# Altium project HYDRA_V4_POWER.PrjPcb (part 1 of 2)
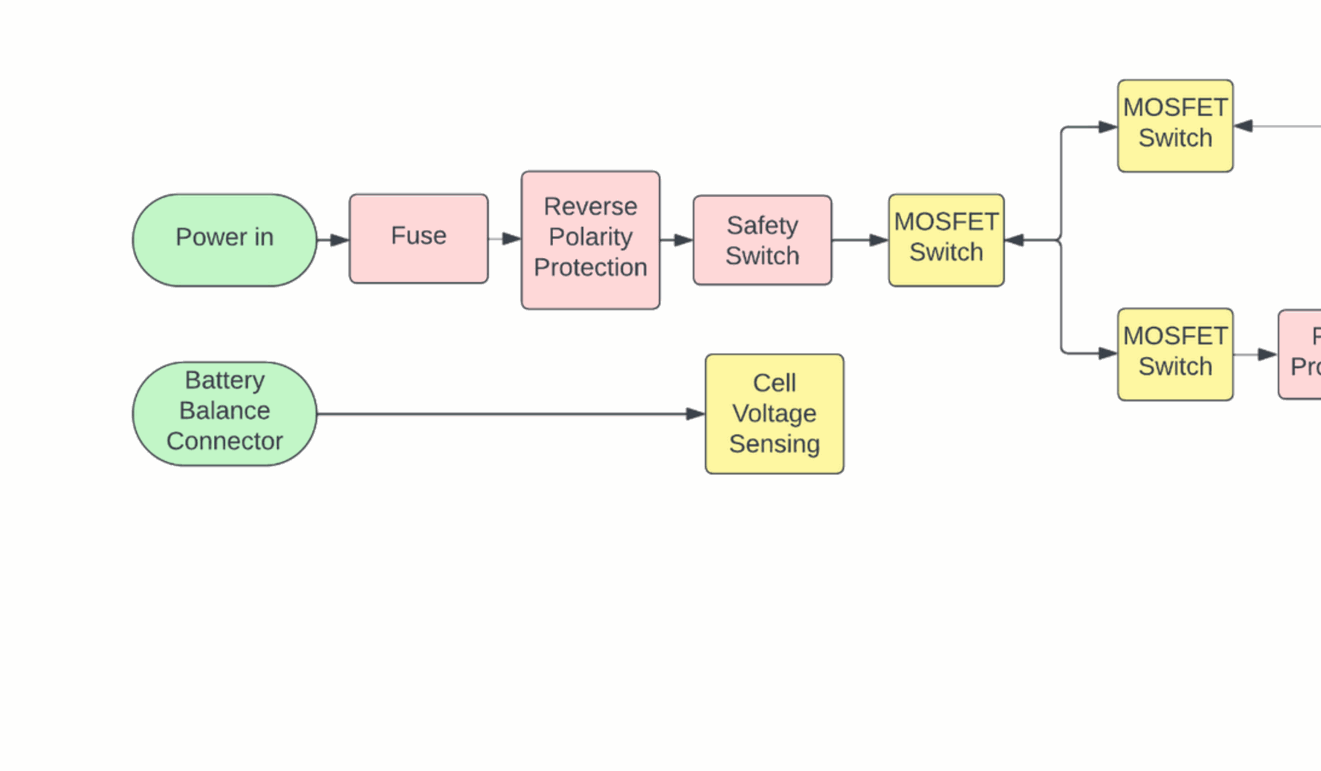
[diagram p0: HYDRA_V4_POWER.SchDoc, top left]
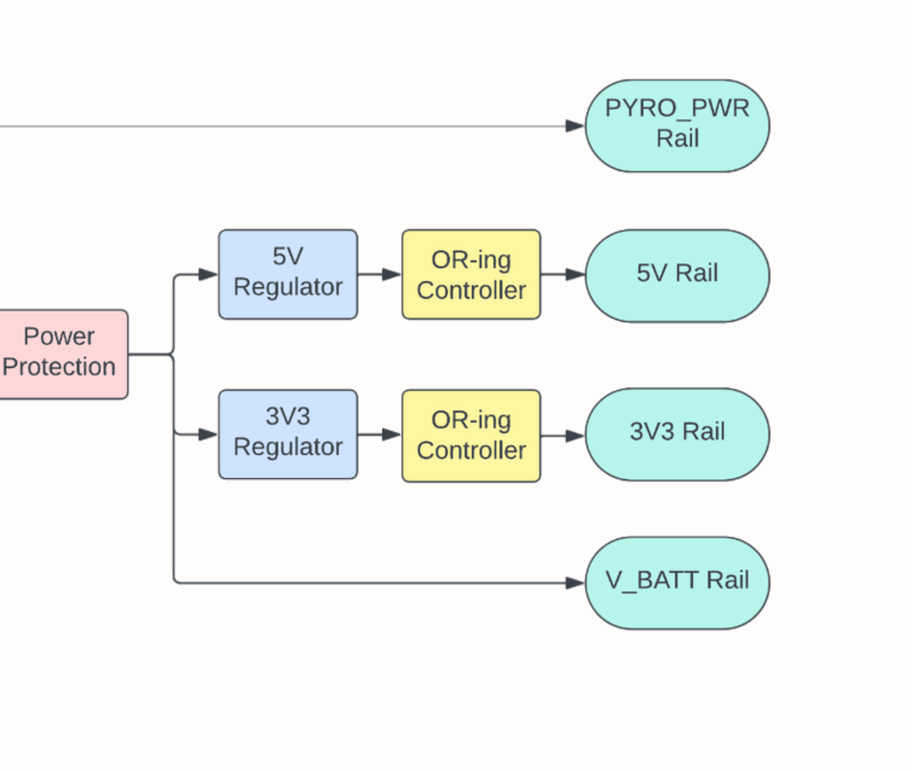
[diagram p1: HYDRA_V4_POWER.SchDoc, top right]
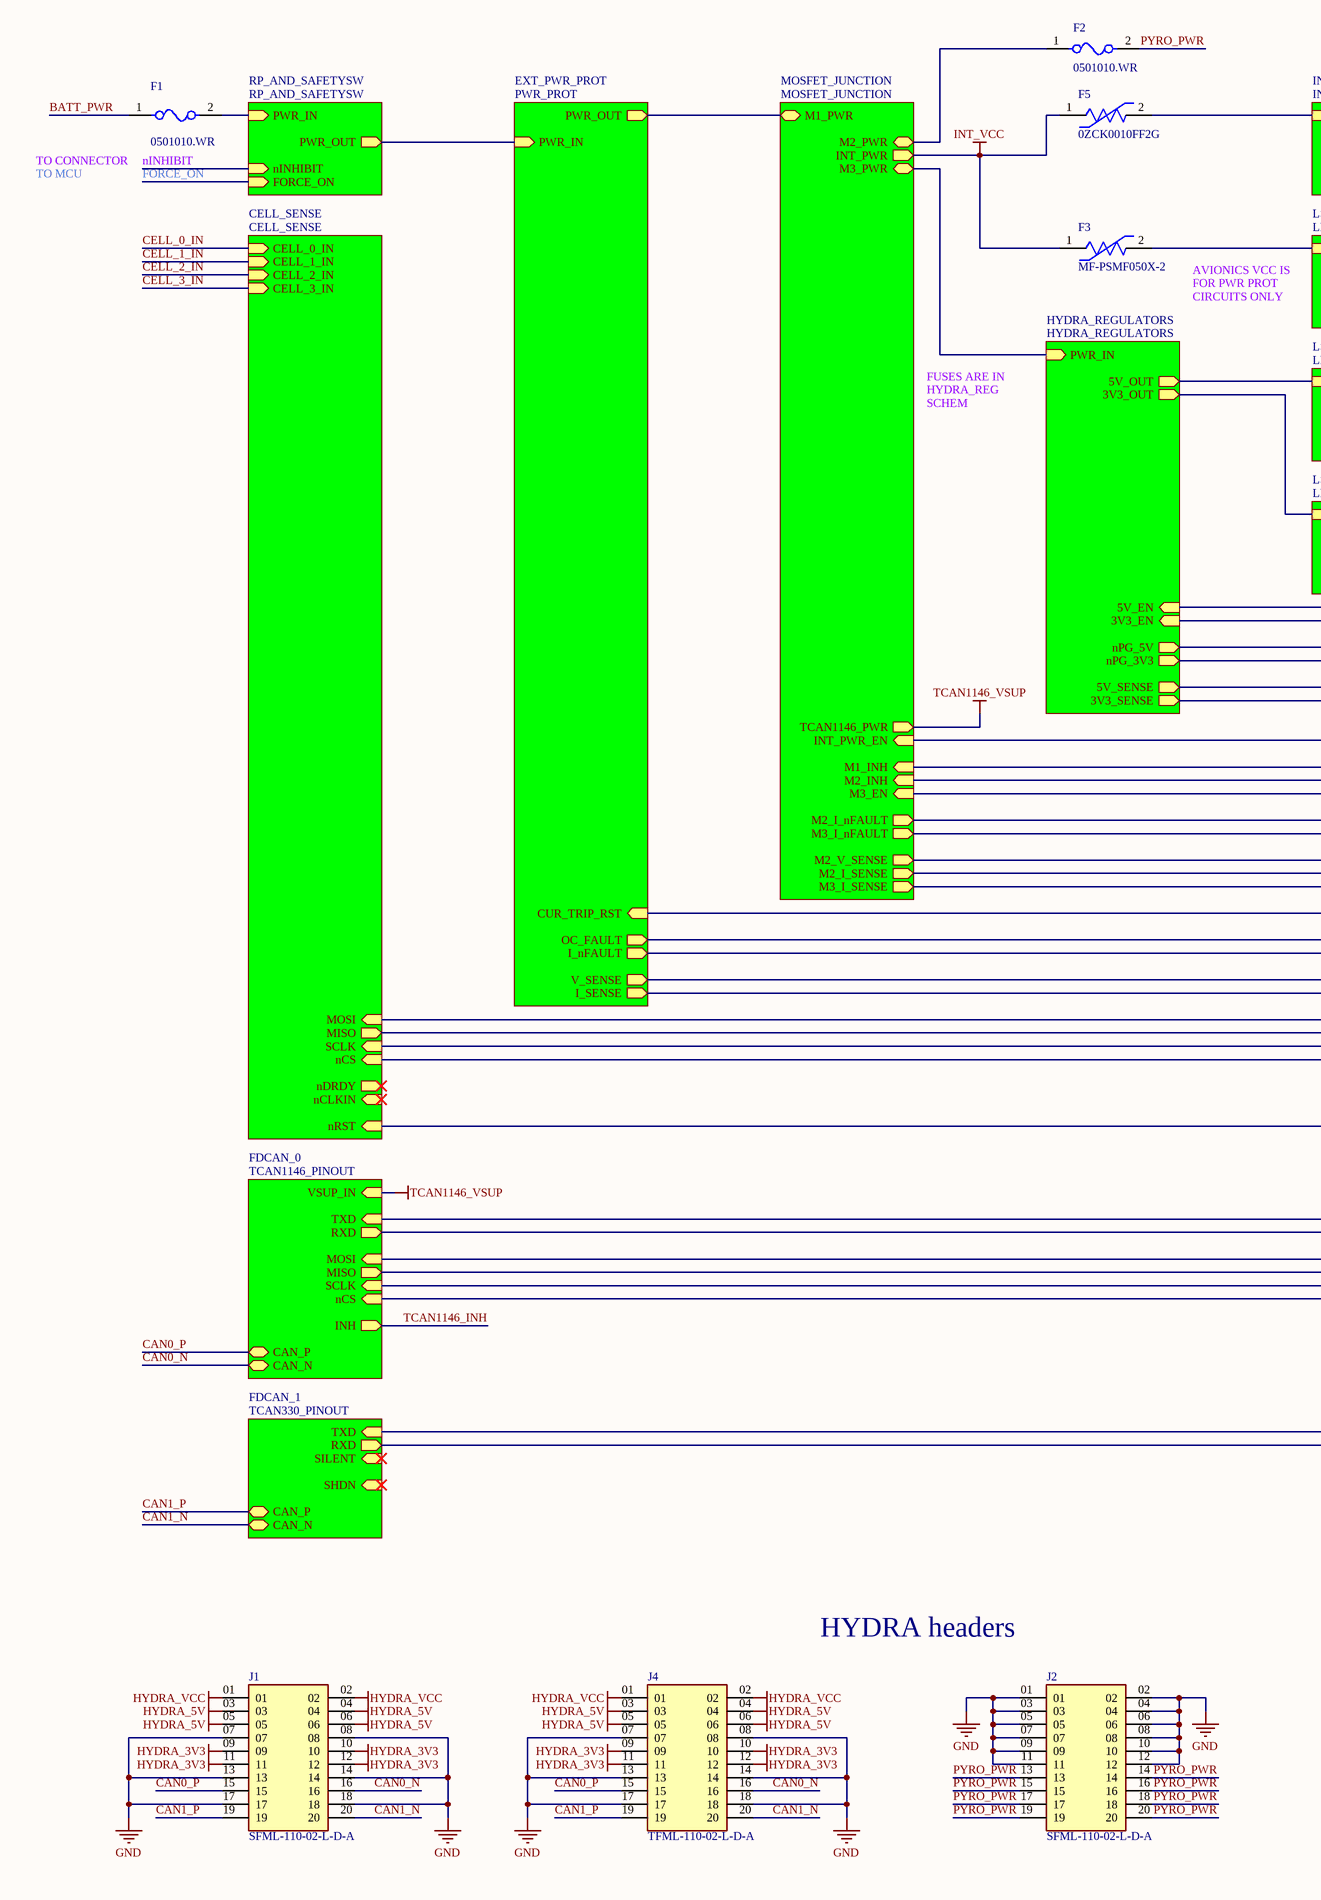
[diagram p2: HYDRA_V4_POWER.SchDoc, bottom left]
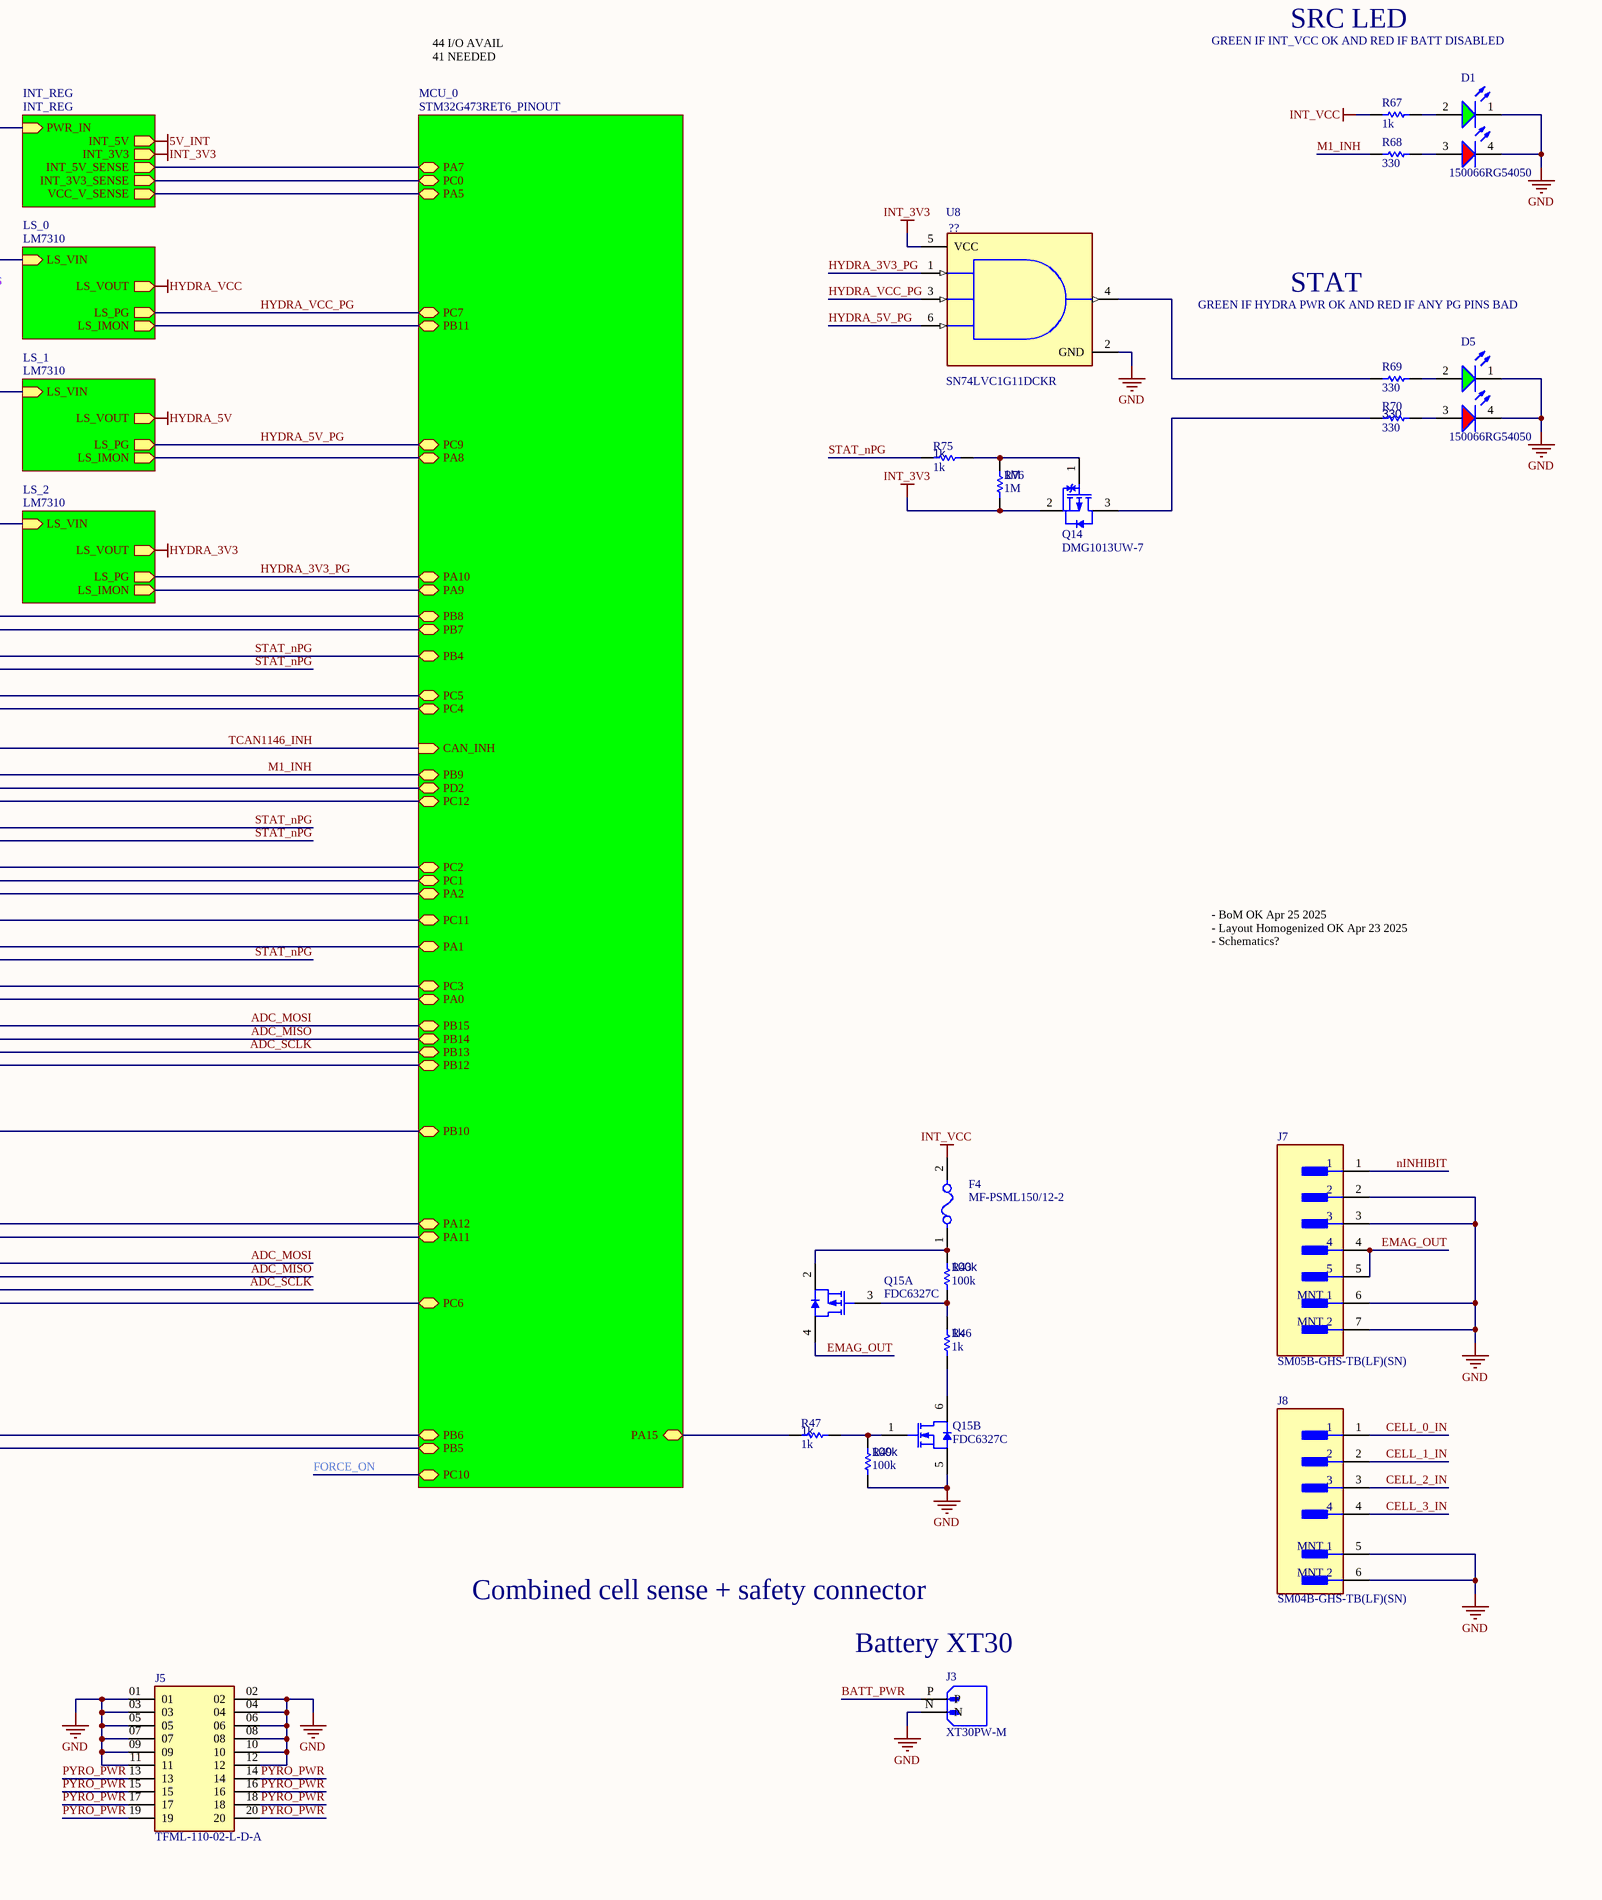
[diagram p3: HYDRA_V4_POWER.SchDoc, bottom right]
11 sheets, 220 parts. Net scope: hierarchical (ports join the sheet entries above them; power ports are global).
Board file: HYDRA_V4_POWER.PcbDoc
Sheets:
  HYDRA_V4_POWER.SchDoc
    MCU_0 = STM32G473RET6_PINOUT.SchDoc
    EXT_PWR_PROT = PWR_PROT.SchDoc
    CELL_SENSE = CELL_SENSE.SchDoc
    MOSFET_JUNCTION = MOSFET_JUNCTION.SchDoc
    INT_REG = INT_REG.SchDoc
    HYDRA_REGULATORS = HYDRA_REGULATORS.SchDoc
    RP_AND_SAFETYSW = RP_AND_SAFETYSW.SchDoc
    LS_0 = LM7310.SchDoc
    LS_1 = LM7310.SchDoc
    LS_2 = LM7310.SchDoc
    FDCAN_1 = TCAN330_PINOUT.SchDoc
    FDCAN_0 = TCAN1146_PINOUT.SchDoc

## Sheet HYDRA_V4_POWER.SchDoc
size A2; SheetNumber: 1; SheetTotal: 11

### Parts
D1  150066RG54050  [WL-SBCD_0606]
D5  150066RG54050  [WL-SBCD_0606]
F1  0501010.WR  [FP-0501-MFG]
F2  0501010.WR  [FP-0501-MFG]
F3  MF-PSMF050X-2  [FP-MF-PSMF-MFG]
F4  MF-PSML150/12-2  [FP-0805L010-MFG]
F5  0ZCK0010FF2G  [FP-0ZCK0010FF2G-MFG]
J1  SFML-110-02-L-D-A  [SFML-110-02-L-D-A-Footprint-1]
J2  SFML-110-02-L-D-A  [SFML-110-02-L-D-A-Footprint-1]
J3  XT30PW-M  [XT30PW-M-Footprint-1]
J4  TFML-110-02-L-D-A  [TFML-110-02-L-D-A-Footprint-1]
J5  TFML-110-02-L-D-A  [TFML-110-02-L-D-A-Footprint-1]
J7  SM05B-GHS-TB(LF)(SN)  [FP-SM05B-GHS-TB_LF_SN-MFG]
J8  SM04B-GHS-TB(LF)(SN)  [FP-SM04B-GHS-TB_LF_SN-MFG]
Q14  DMG1013UW-7  [DIOD-SOT323-3_V]
Q15  FDC6327C  [FAIR-SOT23-6_V]  (parts A,B of 2)
R43  100k  [R0603B]
R46  1k  [R0603B]
R47  1k  [R0603B]
R49  100k  [R0603B]
R67  1k  [R0603B]
R68  330  [R0603B]
R69  330  [R0603B]
R70  330  [R0603B]
R75  1k  [R0603B]
R76  1M  [R0603B]
U8  SN74LVC1G11DCKR  [FP-DCK0006A-MFG]  (value not drawn)

### Sub-sheets
CELL_SENSE = CELL_SENSE: CELL_0_IN (in), CELL_1_IN (in), CELL_2_IN (in), CELL_3_IN (in), MOSI (in), MISO (out), SCLK (in), nCS (in), nRST (in), nDRDY (out), nCLKIN (in)
EXT_PWR_PROT = PWR_PROT: PWR_IN (in), PWR_OUT (out), V_SENSE (out), I_SENSE (out), CUR_TRIP_RST (in), OC_FAULT (out), I_nFAULT (out)
FDCAN_0 = TCAN1146_PINOUT: TXD (in), RXD (out), MOSI (in), MISO (out), SCLK (in), nCS (in), INH (out), CAN_P (bidir), CAN_N (bidir), VSUP_IN (in)
FDCAN_1 = TCAN330_PINOUT: TXD (in), RXD (out), SHDN (in), SILENT (in), CAN_P (bidir), CAN_N (bidir)
HYDRA_REGULATORS = HYDRA_REGULATORS: PWR_IN (in), 5V_OUT (out), 3V3_OUT (out), 5V_SENSE (out), 3V3_SENSE (out), 5V_EN (in), 3V3_EN (in), nPG_3V3 (out), nPG_5V (out)
INT_REG = INT_REG: PWR_IN (in), INT_3V3 (out), INT_3V3_SENSE (out), VCC_V_SENSE (out), INT_5V (out), INT_5V_SENSE (out)
LS_0 = LM7310: LS_VIN (in), LS_VOUT (out), LS_PG (out), LS_IMON (out)
LS_1 = LM7310: LS_VIN (in), LS_VOUT (out), LS_PG (out), LS_IMON (out)
LS_2 = LM7310: LS_VIN (in), LS_VOUT (out), LS_PG (out), LS_IMON (out)
MCU_0 = STM32G473RET6_PINOUT: CAN_INH (in), PB12 (bidir), PB13 (bidir), PB14 (bidir), PB15 (bidir), PA11 (bidir), PA12 (bidir), PB5 (bidir), PB6 (bidir), PC7 (bidir), PB11 (bidir), PC9 (bidir), PA8 (bidir), PA9 (bidir), PA10 (bidir), PC6 (bidir), PA5 (bidir), PC0 (bidir), PB7 (bidir), PB8 (bidir), PB4 (bidir), PC5 (bidir), PC4 (bidir), PB9 (bidir), PD2 (bidir), PC12 (bidir), PC3 (bidir), PC2 (bidir), PA1 (bidir), PC1 (bidir), PA0 (bidir), PB10 (bidir), PC11 (bidir), PA2 (bidir), PA15 (bidir), PC10 (bidir), PA7 (bidir)
MOSFET_JUNCTION = MOSFET_JUNCTION: M1_PWR (bidir), M2_PWR (bidir), M3_PWR (bidir), INT_PWR (out), M2_I_SENSE (out), M3_I_SENSE (out), M2_INH (in), M1_INH (in), M3_EN (in), INT_PWR_EN (in), TCAN1146_PWR (out), M2_V_SENSE (out), M2_I_nFAULT (out), M3_I_nFAULT (out)
RP_AND_SAFETYSW = RP_AND_SAFETYSW: PWR_IN (in), PWR_OUT (out), nINHIBIT (in), FORCE_ON (in)

### Nets
GND: D1.1(K) D1.4(K) D5.1(K) D5.4(K) J1.07 J1.08 J1.13 J1.14 J1.17 J1.18 J2.01 J2.02 J2.03 J2.04 J2.05 J2.06 J2.07 J2.08 J2.09 J2.10 J2.11 J2.12 J3.N J4.07 J4.08 J4.13 J4.14 J4.17 J4.18 J5.01 J5.02 J5.03 J5.04 J5.05 J5.06 J5.07 J5.08 J5.09 J5.10 J5.11 J5.12 J7.2 J7.3 J7.6(MNT_1) J7.7(MNT_2) J8.5(MNT_1) J8.6(MNT_2) Q15.5(S) R49.2 U8.2(GND)
HYDRA_3V3: J1.09 J1.10 J1.11 J1.12 J4.09 J4.10 J4.11 J4.12 ; sheet LS_2/LS_VOUT
HYDRA_5V: J1.03 J1.04 J1.05 J1.06 J4.03 J4.04 J4.05 J4.06 ; sheet LS_1/LS_VOUT
HYDRA_VCC: J1.01 J1.02 J4.01 J4.02 ; sheet LS_0/LS_VOUT
INT_3V3: Q14.2(S) R76.2 U8.5(VCC) ; sheet INT_REG/INT_3V3
INT_VCC: F3.1 F4.2 F5.1 R67.2 ; sheet MOSFET_JUNCTION/INT_PWR  [project net INT_PWR]
TCAN1146_VSUP: sheet MOSFET_JUNCTION/TCAN1146_PWR, sheet FDCAN_0/VSUP_IN  [project net TCAN1146_PWR]
3V3_EN: sheet MCU_0/PB7, sheet HYDRA_REGULATORS/3V3_EN
5V_EN: sheet MCU_0/PB8, sheet HYDRA_REGULATORS/5V_EN
ADC_MISO: sheet MCU_0/PB14, sheet CELL_SENSE/MISO, sheet FDCAN_0/MISO
ADC_MOSI: sheet MCU_0/PB15, sheet CELL_SENSE/MOSI, sheet FDCAN_0/MOSI
ADC_SCLK: sheet MCU_0/PB13, sheet CELL_SENSE/SCLK, sheet FDCAN_0/SCLK
BATT_PWR: F1.1 J3.P
CAN0_N: J1.16 J4.16 ; sheet FDCAN_0/CAN_N
CAN0_P: J1.15 J4.15 ; sheet FDCAN_0/CAN_P
CAN1_N: J1.20 J4.20 ; sheet FDCAN_1/CAN_N
CAN1_P: J1.19 J4.19 ; sheet FDCAN_1/CAN_P
CELL_0_IN: J8.1 ; sheet CELL_SENSE/CELL_0_IN
CELL_1_IN: J8.2 ; sheet CELL_SENSE/CELL_1_IN
CELL_2_IN: J8.3 ; sheet CELL_SENSE/CELL_2_IN
CELL_3_IN: J8.4 ; sheet CELL_SENSE/CELL_3_IN
CUR_TRIP_RST: sheet MCU_0/PC11, sheet EXT_PWR_PROT/CUR_TRIP_RST
EMAG_OUT: J7.4 J7.5 Q15.4(D)
FORCE_ON: sheet MCU_0/PC10, sheet RP_AND_SAFETYSW/FORCE_ON
HYDRA_3V3_PG: U8.1(A) ; sheet MCU_0/PA10, sheet LS_2/LS_PG
HYDRA_5V_PG: U8.6(C) ; sheet MCU_0/PC9, sheet LS_1/LS_PG
HYDRA_VCC_PG: U8.3(B) ; sheet MCU_0/PC7, sheet LS_0/LS_PG
IMON: sheet MCU_0/PA8, sheet LS_1/LS_IMON
IMON: sheet MCU_0/PA9, sheet LS_2/LS_IMON  [a separate net that carries the same name]
IMON: sheet MCU_0/PB11, sheet LS_0/LS_IMON  [a separate net that carries the same name]
M1_INH: R68.2 ; sheet MCU_0/PB9, sheet MOSFET_JUNCTION/M1_INH
M1_PWR: sheet EXT_PWR_PROT/PWR_OUT, sheet MOSFET_JUNCTION/M1_PWR
M2_PWR: F2.1 ; sheet MOSFET_JUNCTION/M2_PWR
M3_I_SENSE: sheet MCU_0/PA2, sheet MOSFET_JUNCTION/M3_I_SENSE
M3_PWR: sheet MOSFET_JUNCTION/M3_PWR, sheet HYDRA_REGULATORS/PWR_IN
nINHIBIT: J7.1 ; sheet RP_AND_SAFETYSW/nINHIBIT
OC_PROT_PWR_IN: sheet EXT_PWR_PROT/PWR_IN, sheet RP_AND_SAFETYSW/PWR_OUT
PYRO_PWR: F2.2 J2.13 J2.14 J2.15 J2.16 J2.17 J2.18 J2.19 J2.20 J5.13 J5.14 J5.15 J5.16 J5.17 J5.18 J5.19 J5.20
STAT_nPG: R75.2 ; sheet MCU_0/PB4, sheet EXT_PWR_PROT/I_nFAULT, sheet MOSFET_JUNCTION/M2_I_nFAULT, sheet MOSFET_JUNCTION/M3_I_nFAULT, sheet HYDRA_REGULATORS/nPG_3V3, sheet HYDRA_REGULATORS/nPG_5V  [project net M2_I_nFAULT]
TCAN1146_INH: sheet MCU_0/CAN_INH, sheet MOSFET_JUNCTION/INT_PWR_EN, sheet FDCAN_0/INH
V_SENSE: sheet MCU_0/PC3, sheet EXT_PWR_PROT/V_SENSE
NetC6_1: F5.2 ; sheet INT_REG/PWR_IN
NetC8_1: sheet HYDRA_REGULATORS/5V_OUT, sheet LS_1/LS_VIN
NetC13_1: sheet HYDRA_REGULATORS/3V3_OUT, sheet LS_2/LS_VIN
NetD1_2: D1.2(A) R67.1
NetD1_3: D1.3(A) R68.1
NetD5_2: D5.2(A) R69.1
NetD5_3: D5.3(A) R70.1
NetD6_1: sheet MCU_0/PA1, sheet EXT_PWR_PROT/OC_FAULT
NetF1_2: F1.2 ; sheet RP_AND_SAFETYSW/PWR_IN
NetF3_2: F3.2 ; sheet LS_0/LS_VIN
NetF4_1: F4.1 Q15.2(S) R43.2
NetQ14_1: Q14.1(G) R75.1 R76.1
NetQ14_3: Q14.3(D) R70.2
NetQ15_1: Q15.1(G) R47.1 R49.1
NetQ15_3: Q15.3(G) R43.1 R46.1
NetQ15_6: Q15.6(D) R46.2
NetR12_2: sheet MCU_0/PC12, sheet MOSFET_JUNCTION/M3_EN
NetR17_2: sheet MCU_0/PD2, sheet MOSFET_JUNCTION/M2_INH
NetR24_1: sheet MCU_0/PA7, sheet INT_REG/INT_5V_SENSE
NetR38_1: sheet MCU_0/PC0, sheet INT_REG/INT_3V3_SENSE
NetR40_1: sheet MCU_0/PA5, sheet INT_REG/VCC_V_SENSE
NetR42_1: sheet MCU_0/PC5, sheet HYDRA_REGULATORS/5V_SENSE
NetR47_2: R47.2 ; sheet MCU_0/PA15
NetR48_1: sheet MCU_0/PC4, sheet HYDRA_REGULATORS/3V3_SENSE
NetR54_1: sheet MCU_0/PC2, sheet MOSFET_JUNCTION/M2_V_SENSE
NetR69_2: R69.2 U8.4(Y)
NetU1_11: sheet MCU_0/PC1, sheet MOSFET_JUNCTION/M2_I_SENSE
NetU4_11: sheet MCU_0/PA0, sheet EXT_PWR_PROT/I_SENSE
NetU9_30: sheet MCU_0/PB10, sheet CELL_SENSE/nRST
NetU9_34: sheet MCU_0/PB12, sheet CELL_SENSE/nCS
NetU9_38: sheet MCU_0/PC6, sheet FDCAN_0/nCS
NetU9_45: sheet MCU_0/PA11, sheet FDCAN_0/RXD
NetU9_46: sheet MCU_0/PA12, sheet FDCAN_0/TXD
NetU9_58: sheet MCU_0/PB5, sheet FDCAN_1/RXD
NetU9_59: sheet MCU_0/PB6, sheet FDCAN_1/TXD

### Notes on the sheet
- GREEN IF INT_VCC OK AND RED IF BATT DISABLED
- SRC LED
- 44 I/O AVAIL
  41 NEEDED
- TO MCU
- TO CONNECTOR
- AVIONICS VCC IS FOR PWR PROT CIRCUITS ONLY
- GREEN IF HYDRA PWR OK AND RED IF ANY PG PINS BAD
- STAT
- FUSES ARE IN HYDRA_REG SCHEM
- - BoM OK Apr 25 2025
  - Layout Homogenized OK Apr 23 2025
  - Schematics?
- HYDRA headers
- Combined cell sense + safety connector
- (near J3) Battery XT30
- (in symbol CMP-0859-00482-4) ??

### Library data of the parts
D1 D5 = CMP-004-00040-2: Led, Red/Grn, 180Mcd/230Mcd, 624Nm/525Nm Rohs Compliant: Yes; Source: rgled.SchLib; Component Type: Standard; Design Item ID: CMP-004-00034-2; Pins: 4
F1 F2 = CMP-08605-000084-1: FUSE BOARD MOUNT 10A 32VDC 1206; Working Voltage: 32V; Approvals: UL; Fuse Type: Board Mount (Cartridge Style Excluded); DC Cold Resistance: 4.27mR; Depth: 1.63mm; Housing Material: Ceramic; Max Operating Temperature: 150°C; Voltage Rating (DC): 32V; Width: 1.63mm; Height: 0.033inch; Current Rating: 10A; Composition: Ceramic; Lead Free: Lead Free; Case Code (Metric): 3216; Min Operating Temperature: -55°C; Packaging: Tape and Reel; Mount: Surface Mount; Case/Package: 1206; Case Code (Imperial): 1206; Package Quantity: 3000; Length: 3.2mm
F3 = CMP-07400-000013-1: PTC RESET FUSE 6V 500MA 0805; Manufacturer: Bourns Inc.; Trip Current: 1A; Trip Time: 0.1s; Value: 0.15-0.9Ω; Hold Current: 0.5A; Current Rating: 40A; Category: Fuse; Temperature: -40°C to +85°C; ComponentLink2Description: Datasheet; Manufacturer Part Number: MF-PSMF050X-2; Temperature Range High: +85°C; Package: MF-PSMF; Device Class L1: Circuit Protection; Lead Free: Yes; ComponentLink2URL: https://www.bourns.com/docs/product-datasheets/mfpsmf.pdf?sfvrsn=9c05cafe_24; Ambient Temperature Range Low: -40°C; Mouser Description: Resettable Fuses - PPTC .50A 6V 0.15ohm Hold .5 Trip 1; Resistance: 0.15-0.9Ω; Automotive: Yes; Ambient Temperature Range High: +85°C; Device Class L2: PTC Resettable Fuses; Temperature Range Low: -40°C; Device Class L3: unset; Octopart: https://octopart.com/mf-psmf050x-2-bourns-7483438; Digikey Description: PTC RESET FUSE 6V 500MA 0805; Height: 0.85mm; RoHS: TRUE; Voltage Rating: 6V
F4 = CMP-00227-00673855-1: NexarPartId: 673855; Minimum Resistance Initial (Rmin): 1Ω; Maximum Resistance 1 Hour (R1max): 6Ω; Max Current Rating: 100A; Power Dissipation: 500mW; Working Voltage: 15V; Time to Trip: 1.5s; Hold Current: 100mA; Trip Current: 300mA; Approvals: TUV, cULus; Min Operating Temperature: -40°C; Case Code (Imperial): 0805; Termination: SMD/SMT; Height: 1mm; Resistance: 6Ω; Case Code (Metric): 2012; Lifecycle Status: Production; Operating Supply Voltage: 15V; Mount: Surface Mount; Voltage Rating: 15V; RoHS: Compliant; Width: 1.5mm; Length: 2.2mm; Voltage Rating (DC): 15V; Ambient Temperature Range High: 85°C; Max Power Dissipation: 500mW; Lead Free: Lead Free; Max Operating Temperature: 85°C; Current Rating: 100A; Terminal Material: Copper; Packaging: Cut Tape; REACH SVHC: No SVHC; Max Voltage Rating (DC): 15V; Case/Package: 0805
F5 = CMP-16043-000017-1: PTC RESET FUSE 15V 100MA 0805; Max Current Rating: 100A; Trip Current: 300mA; Time to Trip: 1.5s; Lead Free: Lead Free; Case/Package: 0805; Package Quantity: 1; Hold Current: 100mA; Case Code (Metric): 2012; Packaging: Tape and Reel; Case Code (Imperial): 0805; RoHS Compliant: Yes
J1 J2 = CMP-002-00043-1: Board Connector, 20 Contact(s), 2 Row(s), Female, Straight, 0.05 inch Pitch, Surface Mount Terminal, Locking, Black Insulator, Socket; RoHS Compliant: Yes; Connector Type: BOARD CONNECTOR; Mounting Technology: Board
J3 = CMP-002-00064-1
J4 J5 = CMP-002-00042-3: Board Connector, 20 Contact(s), 2 Row(s), Male, Straight, Surface Mount Terminal; Connector Type: BOARD CONNECTOR; Mounting Technology: Board; RoHS Compliant: Yes
J7 = CMP-002-00081-1: Connector Header, GH Series, 5 Position, 1.25mm, Surface Mount, Right Angle, Tin, Natural
J8 = CMP-002-00080-1: Conn Shrouded Header HDR 4 POS 1.25mm Solder RA SMD Reel
Q14 = CMP-2000-06170-1: P-Channel Enhancement Mode MOSFET, 310 mW, 20 V, -55 to 150 degC, 3-Pin SOT-323, RoHS, Tape and Reel; Manufacturer: Diodes Inc; Qg Gate Charge: 0.622nC; Drain-Source On Resistance-Max: 750mO; Rated Power Dissipation: 310mW; Drain-to-Source Voltage [Vdss]: 20V; Package Reference: SOT323; Datasheet Version: Rev. 3-2, 09/2013; Package Description: 3-Pin Small Outline Transistor, Body 2 x 1.25 mm, Pitch 0.65 mm; Mounting Technology: SurfaceMount; Manufacturer URL: http://www.diodes.com/; Datasheet URL: http://www.diodes.com/_files/datasheets/ds31861.pdf; Channel Type: P-Channel
Q15 = CMP-2000-04939-1: Dual N & P-Channel 2.5 V Specified PowerTrench(TM) MOSFET, -55 to 150 degC, 6-Pin SOT-23, RoHS, Tape and Reel; Manufacturer: Fairchild; Typical Rise Time: 9@NChannel; Rad Hard: No; Maximum Drain Source Voltage: 20V; Typical Fall Time: 3@NChannel; Typical Turn-On Delay Time: 5@NChannel; Maximum Continuous Drain Current: 2.7@NChannel; Typical Turn-Off Delay Time: 12@NChannel; RDS-on: 80@4.5V@NChannel; Channel Mode: Enhancement; Maximum Gate Source Voltage: ±8V; Package Version: Rev. 5, 05/2015; Operating Temperature: -55to150degC; Packaging: Tape&Reel; Package Reference: SOT23-6; Package URL: https://www.fairchildsemi.com/package-drawings/MA/MA06A.pdf; Package Description: 6-Pin Small Outline Transistor, Body 2.9 x 1.6 mm, Pitch 0.95 mm; Manufacturer URL: https://www.fairchildsemi.com/; Channel Type: N; Datasheet Version: Rev. E, 07/2000; Package: 6SuperSOT; Datasheet URL: https://www.fairchildsemi.com/datasheets/FD/FDC6327C.pdf; Mounting: SurfaceMount; Category: MOSFET
R43 R46 R47 R49 R67-R70 R75 R76 = CMP-009-00002-14: Resistor
  R43 R49: Value: 100k
  R46 R47 R67 R75: Value: 1k
  R68-R70: Value: 330
  R76: Value: 1M
U8 = CMP-0859-00482-4: IC GATE AND 1CH 3-INP SC70-6; Manufacturer: Texas Instruments; Number Of Circuits: 1; Min Supply Voltage: 1.5V; Max Supply Voltage: 5.5V; Max Junction Temp: +150°C; Standoff Height: 0mm; Number Of Inputs: 3; Propagation Delay: 4.6ns; Logic Function Desc: Non-Inverting; Nominal Supply Current: 10uA; Lead Free: Yes; Digikey Description: IC GATE AND 1CH 3-INP SC70-6; Device Class L1: Integrated Circuits (ICs); Temperature Range High: +125°C; Manufacturer Part Number: SN74LVC1G11DCKR; Number Of Outputs: 1; Temperature Range Low: -40°C; Device Class L3: Logic Gates; RoHS: TRUE; Temperature: -40°C to +125°C; Ambient Temperature Range High: +125°C; Mouser Description: Logic Single 3-Input And Gate, 3.5ns, Sc70-6, Full Reel; Device Class L2: Logic ICs; Category: IC; ComponentLink2URL: http://www.ti.com/lit/ds/symlink/sn74lvc1g11.pdf; ComponentLink2Description: Datasheet; Automotive: No; Package: DCK0006A; Ambient Temperature Range Low: -40°C; Height: 1.1mm; Octopart: https://octopart.com/sn74lvc1g11dckr-texas+instruments-464959

## Sheet STM32G473RET6_PINOUT.SchDoc
size C; SheetNumber: 11; SheetTotal: 11
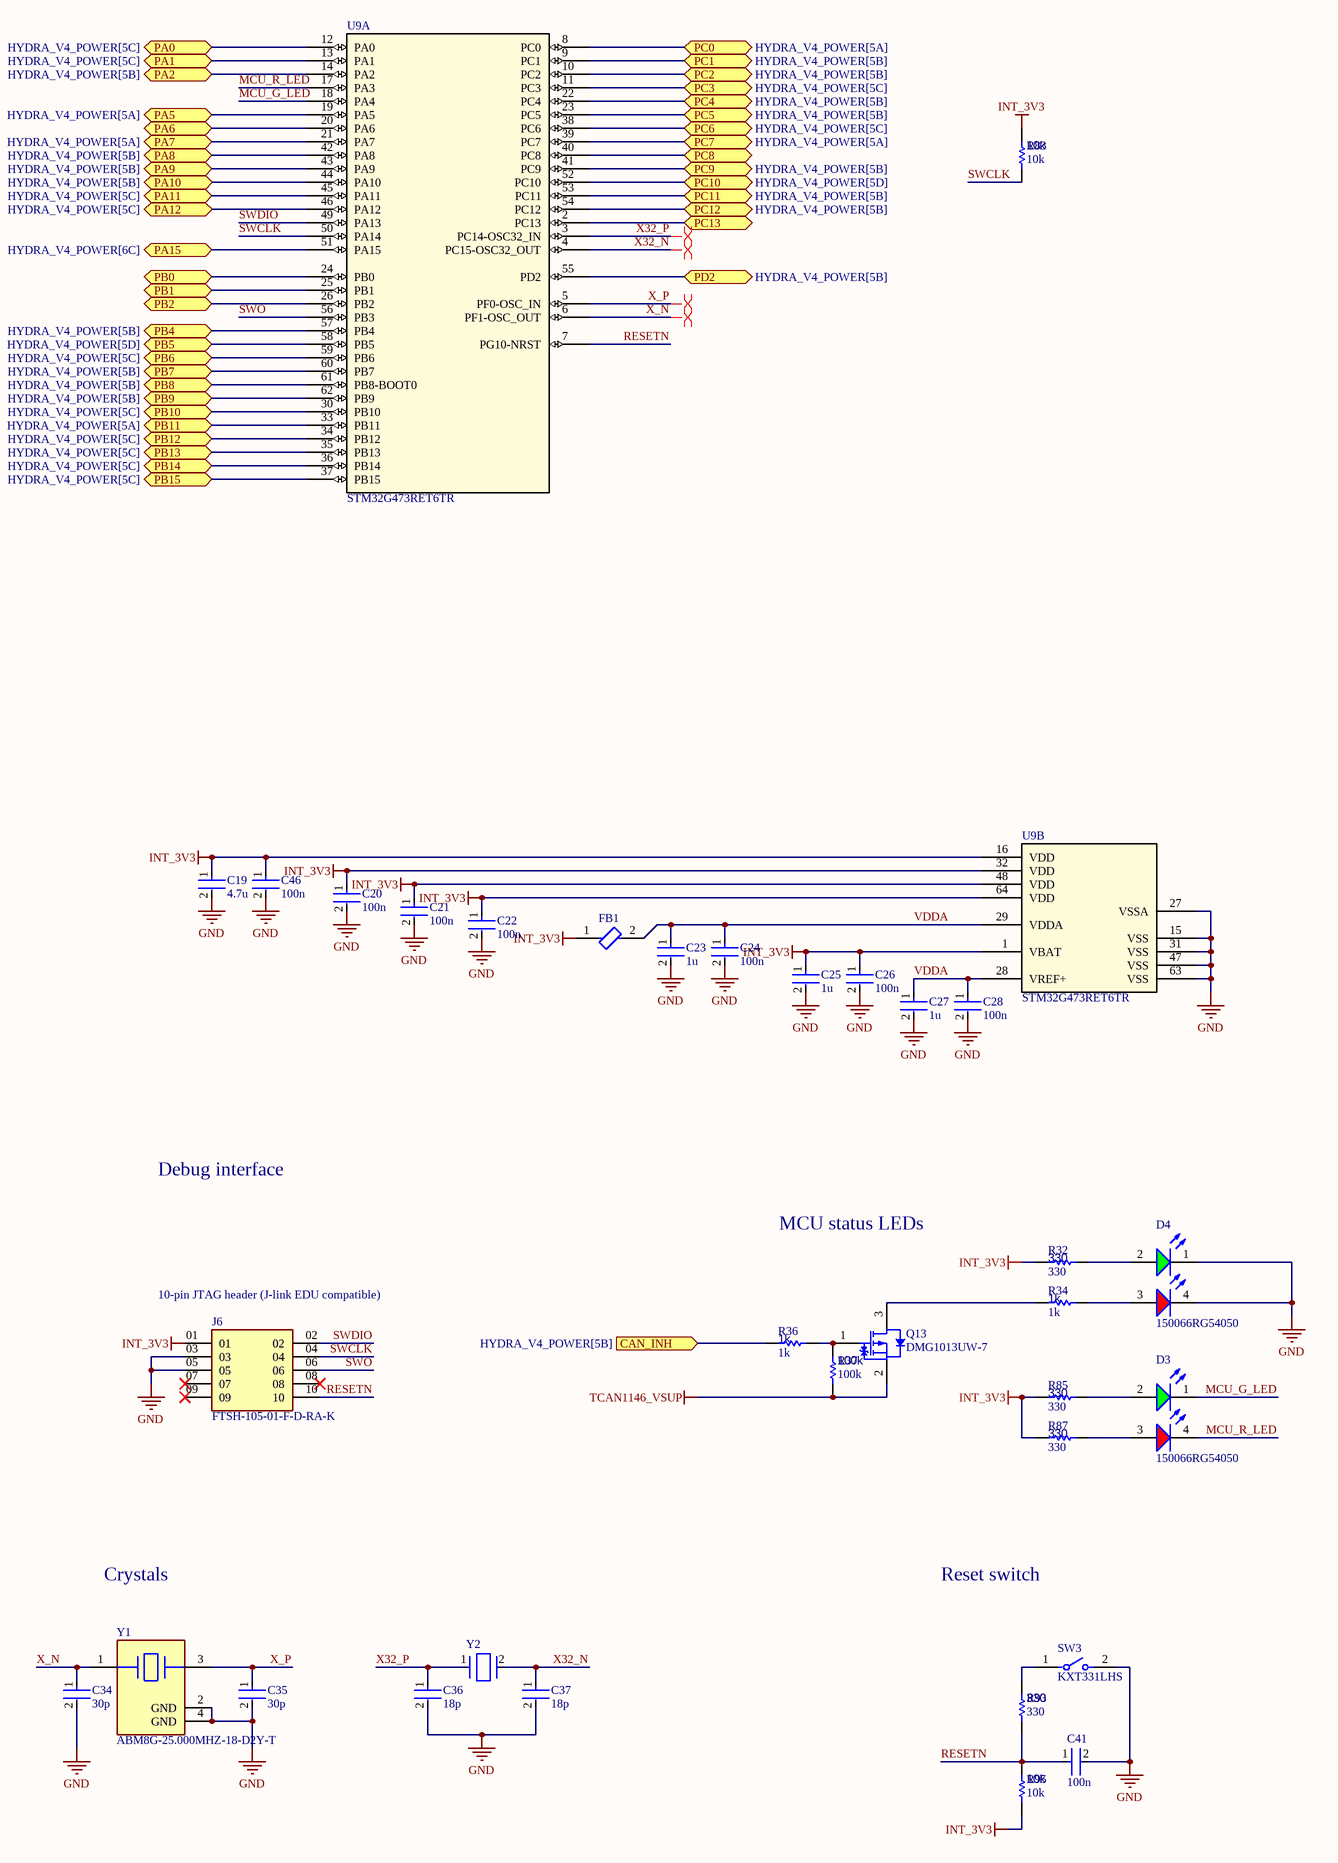
[diagram p4: STM32G473RET6_PINOUT.SchDoc]

### Parts
C19  4.7u  [FP-0402-L_1_0_0_05-W_0_5-IPC_A]
C20  100n  [FP-0402-L_1_0_0_05-W_0_5-IPC_A]
C21  100n  [FP-0402-L_1_0_0_05-W_0_5-IPC_A]
C22  100n  [FP-0402-L_1_0_0_05-W_0_5-IPC_A]
C23  1u  [FP-0402-L_1_0_0_05-W_0_5-IPC_A]
C24  100n  [FP-0402-L_1_0_0_05-W_0_5-IPC_A]
C25  1u  [FP-0402-L_1_0_0_05-W_0_5-IPC_A]
C26  100n  [FP-0402-L_1_0_0_05-W_0_5-IPC_A]
C27  1u  [FP-0402-L_1_0_0_05-W_0_5-IPC_A]
C28  100n  [FP-0402-L_1_0_0_05-W_0_5-IPC_A]
C34  30p  [FP-0402-L_1_0_0_05-W_0_5-IPC_A]
C35  30p  [FP-0402-L_1_0_0_05-W_0_5-IPC_A]
C36  18p  [FP-0402-L_1_0_0_05-W_0_5-IPC_A]
C37  18p  [FP-0402-L_1_0_0_05-W_0_5-IPC_A]
C41  100n  [FP-0402-L_1_0_0_05-W_0_5-IPC_A]
C46  100n  [FP-0402-L_1_0_0_05-W_0_5-IPC_A]
D3  150066RG54050  [WL-SBCD_0606]
D4  150066RG54050  [WL-SBCD_0606]
FB1  BLM15PX601SN1D  [FP-BLM15-0_05-MFG]  (value not drawn)
J6  FTSH-105-01-F-D-RA-K  [FTSH-105-01-F-D-RA-K-Footprint-1]
Q13  DMG1013UW-7  [DIOD-SOT323-3_V]
R32  330  [R0603B]
R34  1k  [R0603B]
R36  1k  [R0603B]
R37  100k  [R0603B]
R83  10k  [R0603B]
R85  330  [R0603B]
R87  330  [R0603B]
R93  330  [R0603B]
R95  10k  [R0603B]
SW3  KXT331LHS  [FP-KXT331LHS-MFG]
U9  STM32G473RET6TR  [STM32G473RET6TR-Footprint-1]  (parts A,B of 2)
Y1  ABM8G-25.000MHZ-18-D2Y-T  [FP-ABM8G-MFG]
Y2  ECS-.327-12.5-1210-TR  [FP-ECX-1210-MFG]  (value not drawn)

### Ports
CAN_INH (in, see HYDRA_V4_POWER[5B]), PA0 (bidir, see HYDRA_V4_POWER[5C]), PA1 (bidir, see HYDRA_V4_POWER[5C]), PA2 (bidir, see HYDRA_V4_POWER[5B]), PA5 (bidir, see HYDRA_V4_POWER[5A]), PA6 (bidir), PA7 (bidir, see HYDRA_V4_POWER[5A]), PA8 (bidir, see HYDRA_V4_POWER[5B]), PA9 (bidir, see HYDRA_V4_POWER[5B]), PA10 (bidir, see HYDRA_V4_POWER[5B]), PA11 (bidir, see HYDRA_V4_POWER[5C]), PA12 (bidir, see HYDRA_V4_POWER[5C]), PA15 (bidir, see HYDRA_V4_POWER[6C]), PB0 (bidir), PB1 (bidir), PB2 (bidir), PB4 (bidir, see HYDRA_V4_POWER[5B]), PB5 (bidir, see HYDRA_V4_POWER[5D]), PB6 (bidir, see HYDRA_V4_POWER[5C]), PB7 (bidir, see HYDRA_V4_POWER[5B]), PB8 (bidir, see HYDRA_V4_POWER[5B]), PB9 (bidir, see HYDRA_V4_POWER[5B]), PB10 (bidir, see HYDRA_V4_POWER[5C]), PB11 (bidir, see HYDRA_V4_POWER[5A]), PB12 (bidir, see HYDRA_V4_POWER[5C]), PB13 (bidir, see HYDRA_V4_POWER[5C]), PB14 (bidir, see HYDRA_V4_POWER[5C]), PB15 (bidir, see HYDRA_V4_POWER[5C]), PC0 (bidir, see HYDRA_V4_POWER[5A]), PC1 (bidir, see HYDRA_V4_POWER[5B]), PC2 (bidir, see HYDRA_V4_POWER[5B]), PC3 (bidir, see HYDRA_V4_POWER[5C]), PC4 (bidir, see HYDRA_V4_POWER[5B]), PC5 (bidir, see HYDRA_V4_POWER[5B]), PC6 (bidir, see HYDRA_V4_POWER[5C]), PC7 (bidir, see HYDRA_V4_POWER[5A]), PC8 (bidir), PC9 (bidir, see HYDRA_V4_POWER[5B]), PC10 (bidir, see HYDRA_V4_POWER[5D]), PC11 (bidir, see HYDRA_V4_POWER[5B]), PC12 (bidir, see HYDRA_V4_POWER[5B]), PC13 (bidir), PD2 (bidir, see HYDRA_V4_POWER[5B])

### Nets
GND: C19.2 C20.2 C21.2 C22.2 C23.2 C24.2 C25.2 C26.2 C27.2 C28.2 C34.2 C35.2 C36.2 C37.2 C41.2 C46.2 D4.1(K) D4.4(K) J6.03 J6.05 SW3.2 U9.15(VSS) U9.27(VSSA) U9.31(VSS) U9.47(VSS) U9.63(VSS) Y1.2(GND) Y1.4(GND)
INT_3V3: C19.1 C20.1 C21.1 C22.1 C25.1 C26.1 C46.1 FB1.1 J6.01 R32.2 R83.2 R85.2 R87.2 R95.1 U9.1(VBAT) U9.16(VDD) U9.32(VDD) U9.48(VDD) U9.64(VDD)
TCAN1146_VSUP: Q13.2(S) R37.2  [project net TCAN1146_PWR]
3V3_EN: U9.60(PB7) ; port PB7
5V_EN: U9.61(PB8-BOOT0) ; port PB8
ADC_MISO: U9.36(PB14) ; port PB14
ADC_MOSI: U9.37(PB15) ; port PB15
ADC_SCLK: U9.35(PB13) ; port PB13
CUR_TRIP_RST: U9.53(PC11) ; port PC11
FORCE_ON: U9.52(PC10) ; port PC10
HYDRA_3V3_PG: U9.44(PA10) ; port PA10
HYDRA_5V_PG: U9.41(PC9) ; port PC9
HYDRA_VCC_PG: U9.39(PC7) ; port PC7
IMON: U9.42(PA8) ; port PA8
IMON: U9.43(PA9) ; port PA9  [a separate net that carries the same name]
IMON: U9.33(PB11) ; port PB11  [a separate net that carries the same name]
M1_INH: U9.62(PB9) ; port PB9
M2_I_nFAULT: U9.57(PB4) ; port PB4
M3_I_SENSE: U9.14(PA2) ; port PA2
MCU_G_LED: D3.1(K) U9.18(PA4)
MCU_R_LED: D3.4(K) U9.17(PA3)
RESETN: C41.1 J6.10 R93.1 R95.2 U9.7(PG10-NRST)
SWCLK: J6.04 R83.1 U9.50(PA14)
SWDIO: J6.02 U9.49(PA13)
SWO: J6.06 U9.56(PB3)
TCAN1146_INH: R36.2 ; port CAN_INH
V_SENSE: U9.11(PC3) ; port PC3
VDDA: C23.1 C24.1 C27.1 C28.1 FB1.2 U9.28(VREF+) U9.29(VDDA)
X32_N: C37.1 U9.4(PC15-OSC32_OUT) Y2.2(Out/In)
X32_P: C36.1 U9.3(PC14-OSC32_IN) Y2.1(In/Out)
X_N: C34.1 U9.6(PF1-OSC_OUT) Y1.1
X_P: C35.1 U9.5(PF0-OSC_IN) Y1.3
NetD3_2: D3.2(A) R85.1
NetD3_3: D3.3(A) R87.1
NetD4_2: D4.2(A) R32.1
NetD4_3: D4.3(A) R34.1
NetD6_1: U9.13(PA1) ; port PA1
NetQ13_1: Q13.1(G) R36.1 R37.1
NetQ13_3: Q13.3(D) R34.2
NetR12_2: U9.54(PC12) ; port PC12
NetR17_2: U9.55(PD2) ; port PD2
NetR24_1: U9.21(PA7) ; port PA7
NetR38_1: U9.8(PC0) ; port PC0
NetR40_1: U9.19(PA5) ; port PA5
NetR42_1: U9.23(PC5) ; port PC5
NetR47_2: U9.51(PA15) ; port PA15
NetR48_1: U9.22(PC4) ; port PC4
NetR54_1: U9.10(PC2) ; port PC2
NetR93_2: R93.2 SW3.1
NetU1_11: U9.9(PC1) ; port PC1
NetU4_11: U9.12(PA0) ; port PA0
NetU9_2: U9.2(PC13) ; port PC13
NetU9_20: U9.20(PA6) ; port PA6
NetU9_24: U9.24(PB0) ; port PB0
NetU9_25: U9.25(PB1) ; port PB1
NetU9_26: U9.26(PB2) ; port PB2
NetU9_30: U9.30(PB10) ; port PB10
NetU9_34: U9.34(PB12) ; port PB12
NetU9_38: U9.38(PC6) ; port PC6
NetU9_40: U9.40(PC8) ; port PC8
NetU9_45: U9.45(PA11) ; port PA11
NetU9_46: U9.46(PA12) ; port PA12
NetU9_58: U9.58(PB5) ; port PB5
NetU9_59: U9.59(PB6) ; port PB6

Not connected (* = marked no-connect by the designer): J6 07* 08* 09*

### Layout directives
differential pair: X32_N, X32_P, X_N, X_P

### Notes on the sheet
- Debug interface
- MCU status LEDs
- (near J6) 10-pin JTAG header (J-link EDU compatible)
- Crystals
- Reset switch

### Library data of the parts
C19-C28 C34-C37 C41 C46 = CMP-001-00058-1: LARGE PADS, 0402 CAP, CHANGE COMMENT TO MATCH REAL P/N; Capacitor Type: Ceramic; Min Operating Temperature: -55°C; Mounting Technology: Surface Mount; Pins: 2; Case/Package: 0402; RoHS Compliant: Yes; Max Operating Temperature: 85°C
  C19: Value: 4.7u
  C20-C22 C24 C26 C28 C41 C46: Value: 100n
  C23 C25 C27: Value: 1u
  C34 C35: Value: 30p
  C36 C37: Value: 18p
D3 D4 = CMP-004-00040-2: as D1 on sheet HYDRA_V4_POWER; Source: rgled.SchLib; Component Type: Standard; Design Item ID: CMP-004-00034-2; Pins: 4
FB1 = CMP-0686-00252-4: Chip Ferrite Bead, 0402, 600Ω @ 100MHz, 0.23Ω, 25%, 900mA; Number of Circuits: 1; Impedance: 600R; DC Resistance (DCR): 230mR; Material: Steel; Length: 1mm; Package Quantity: 10000; Height: 0.5mm; Width: 0.5mm; Max DC Current: 900mA; Number of Lines: 1; Termination: SMD/SMT; Packaging: Tape and Reel; Lead Free: Lead Free; Min Operating Temperature: -55°C; Max Operating Temperature: 125°C; Max Current Rating: 900mA; Case Code (Imperial): 0402; Number of Pins: 2; Current Rating: 900mA; Test Frequency: 100MHz; Case/Package: 0402; Tolerance: 25%; Case Code (Metric): 1005
J6 = CMP-002-00041-5: Board Connector, 10 Contact(s), 2 Row(s), Male, Right Angle, 0.05 inch Pitch, Surface Mount Terminal, Locking, Black Insulator; Connector Type: BOARD CONNECTOR; Mounting Technology: Board; RoHS Compliant: Yes
Q13 = CMP-2000-06170-1: as Q14 on sheet HYDRA_V4_POWER; Package Reference: SOT323; Datasheet Version: Rev. 3-2, 09/2013; Package Description: 3-Pin Small Outline Transistor, Body 2 x 1.25 mm, Pitch 0.65 mm; Mounting Technology: SurfaceMount; Manufacturer URL: http://www.diodes.com/; Datasheet URL: http://www.diodes.com/_files/datasheets/ds31861.pdf; Channel Type: P-Channel
R32 R34 R36 R37 R83 R85 R87 R93 R95 = CMP-009-00002-14: Resistor
  R32 R85 R87 R93: Value: 330
  R34 R36: Value: 1k
  R37: Value: 100k
  R83 R95: Value: 10k
SW3 = CMP-10040-000029-1: SWITCH TACTILE SPST-NO 0.02A 15V; Operating Force: 240gf; Switch Travel: 0.13mm; Illumination Type: Non-Illuminated; Throw Configuration: SPST; Number of Ports: 1; Current Rating: 5A; Mechanical Life: 500000Cycles; Switch Function: Off-Mom; Connector Type: USB; Actuator Type: Standard; Gender: Receptacle; Number of Contacts: 24; Contact Plating: Gold; Insulation Color: Black; Min Operating Temperature: -40°C; Packaging: Tape and Reel; Flammability Rating: UL94 V-0; Max Operating Temperature: 85°C; Termination: Solder; Mount: Surface Mount
U9 = CMP-020-00020-2: MCU 32-Bit STM32 ARM Cortex-M4 RISC 512KB Flash 1.71V to 3.6V 64-Pin LQFP T/R; RoHS Compliant: Yes
Y1 = CMP-2000-05733-3: Crystal 25MHz ±20ppm (Tol) ±30ppm (Stability) 18pF FUND 60Ω 4-Pin SMD T/R; Series Resistance: 60R; Length: 3.2mm; Depth: 2.5mm; Packaging: Tape and Reel; Min Operating Temperature: -40°C; Operating Frequency: 25 MHz; Lead Free: Lead Free; Number of Pins: 4; Frequency Tolerance: 20ppm; Radiation Hardening: No; Max Operating Temperature: 85°C; Termination: SMD/SMT; Frequency Stability: 30ppm; Frequency: 25MHz; Series: ABM8G; Mount: Surface Mount; Package Quantity: 1000; Height: 0.039inch; Width: 0.098inch; Case/Package: CSMD; ESR (Equivalent Series Resistance): 60R; Load Capacitance: 18pF; Tolerance: 20ppm
Y2 = CMP-40224-000006-1: CRYSTAL 32.7680KHZ 12.5PF SMD; Manufacturer: ECS International; Frequency: 32.768kHz; Esr: 90kΩ; Tolerance: 20ppm; Device Class L1: Passive Components; Load Capacitance: 12.5pF; Temperature: -40°C to +85°C; ComponentLink2URL: https://ecsxtal.com/store/pdf/ECX-1210.pdf; Series: ECX-1210; Octopart: https://octopart.com/ecs-.327-12.5-1210-tr-ecs+international-81221340; ComponentLink2Description: Datasheet; Temperature Range Low: -40°C; Digikey Description: CRYSTAL 32.7680KHZ 12.5PF SMD; Lead Free: Yes; RoHS: TRUE; Device Class L3: Crystals; Automotive: No; Category: Crys; Height: 0.5mm; Manufacturer Part Number: ECS-.327-12.5-1210-TR; Temperature Range High: +85°C; Device Class L2: Crystals / Oscillators; Package: ECX-1210

## Sheet PWR_PROT.SchDoc
size B; SheetNumber: 3; SheetTotal: 11
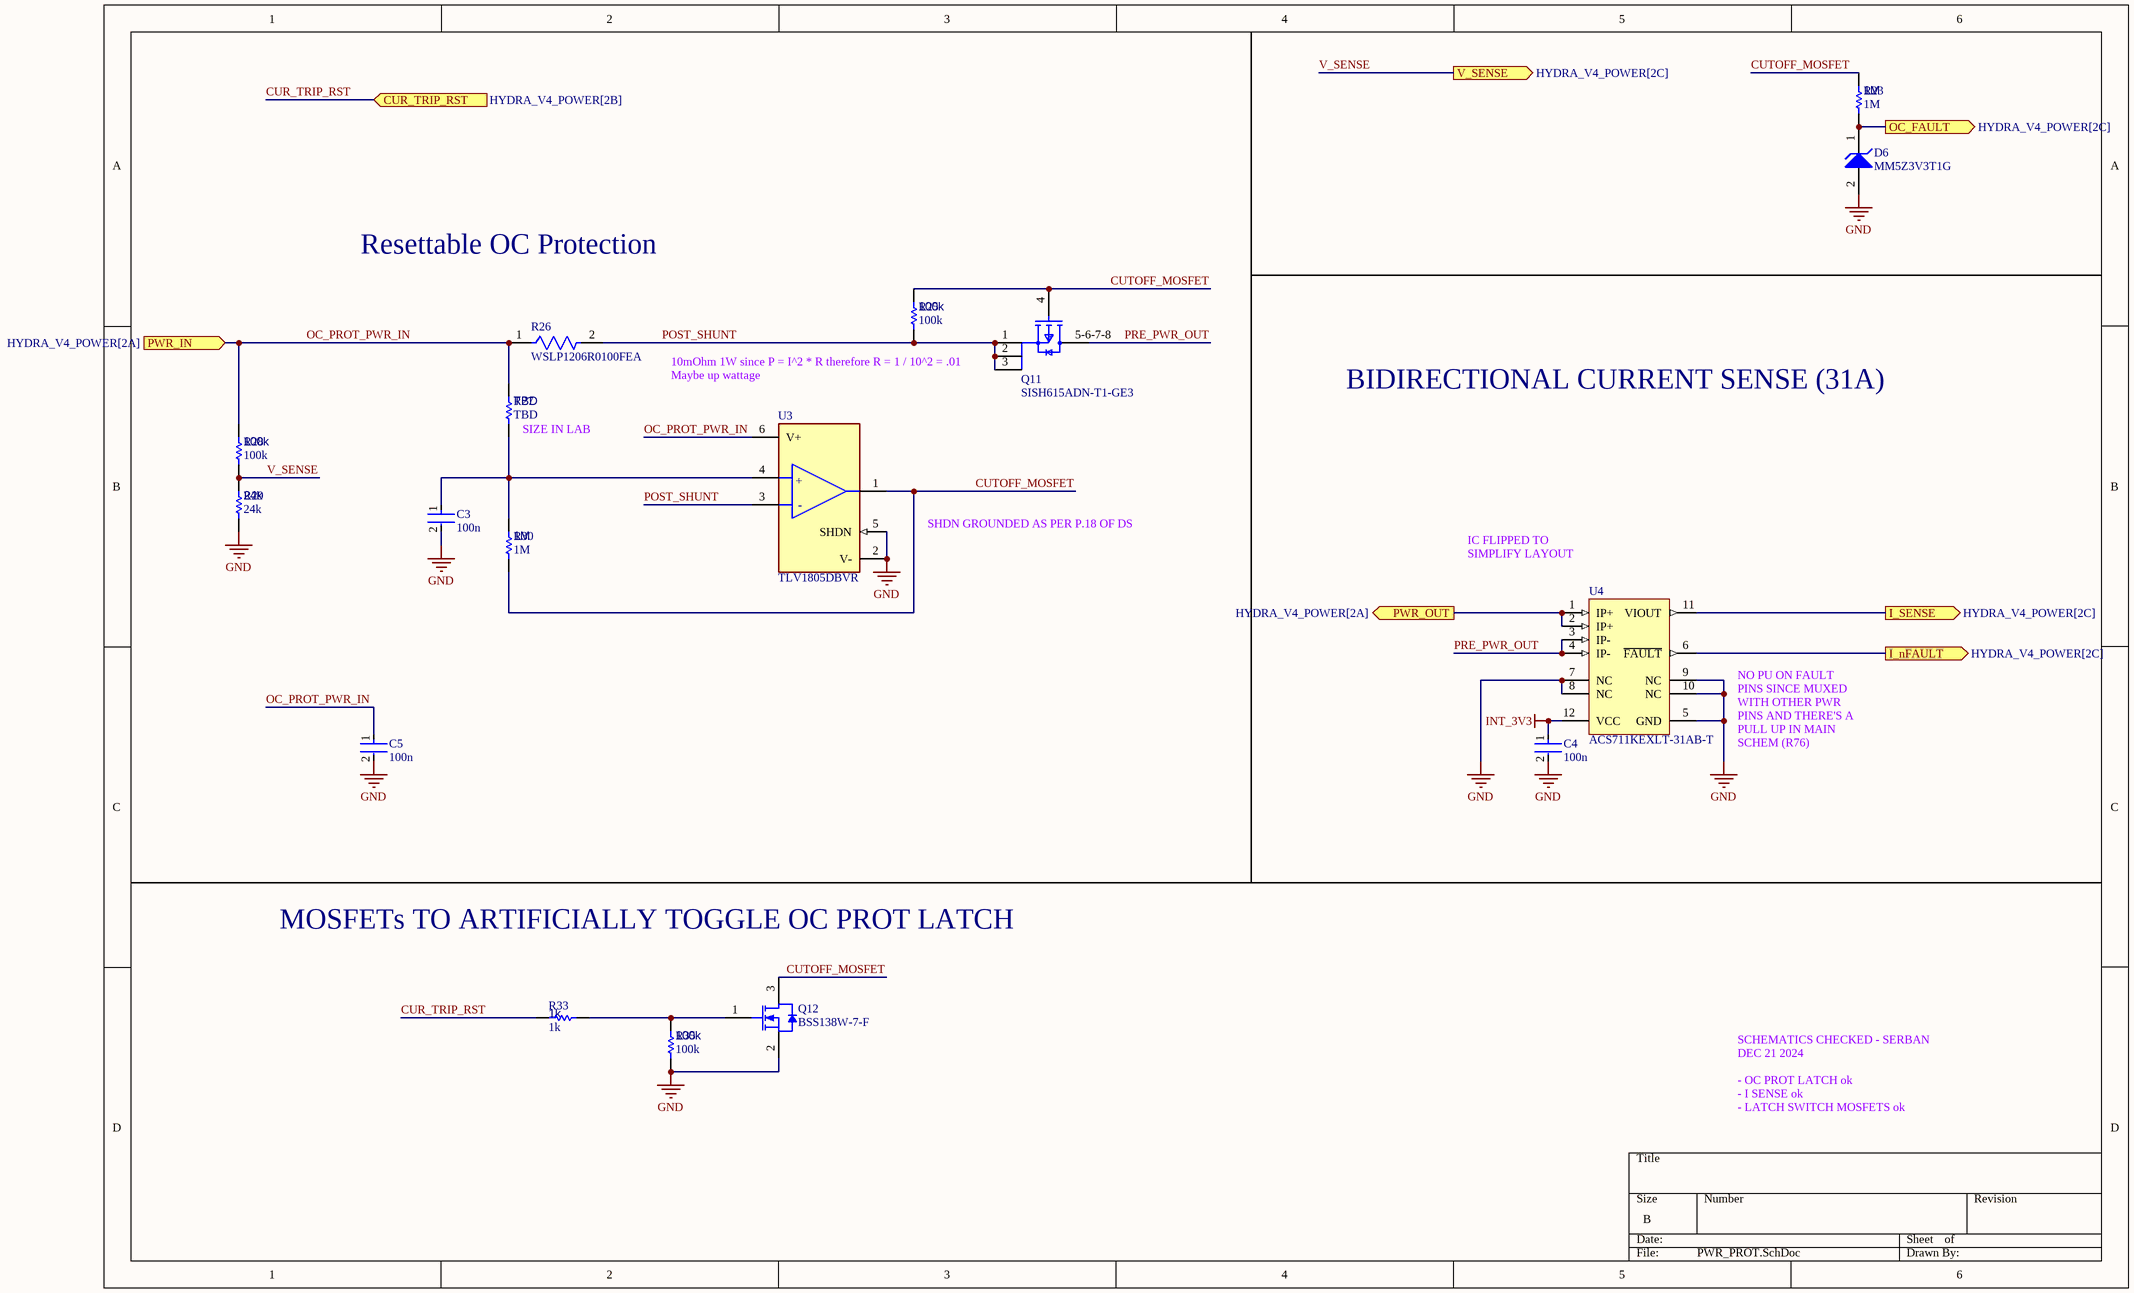
[diagram p5: PWR_PROT.SchDoc]

### Parts
C3  100n  [FP-0402-L_1_0_0_05-W_0_5-IPC_A]
C4  100n  [FP-0402-L_1_0_0_05-W_0_5-IPC_A]
C5  100n  [FP-0402-L_1_0_0_05-W_0_5-IPC_A]
D6  MM5Z3V3T1G  [ONSC-SOD-523-2-502-01_V]
Q11  SISH615ADN-T1-GE3  [SISH615ADN-T1-GE3-Footprint-1]
Q12  BSS138W-7-F  [DIOD-SOT323-3_V]
R23  1M  [R0603B]
R25  100k  [R0603B]
R26  WSLP1206R0100FEA  [FP-WSLP1206-FP_1_65x1_93x-MFG]
R27  TBD  [R0603B]
R28  100k  [R0603B]
R29  24k  [R0603B]
R30  1M  [R0603B]
R33  1k  [R0603B]
R35  100k  [R0603B]
U3  TLV1805DBVR  [FP-DBV0006A-IPC_C]
U4  ACS711KEXLT-31AB-T  [ALEG-EX-12_V]

### Ports
CUR_TRIP_RST (in, see HYDRA_V4_POWER[2B]), I_nFAULT (out, see HYDRA_V4_POWER[2C]), I_SENSE (out, see HYDRA_V4_POWER[2C]), OC_FAULT (out, see HYDRA_V4_POWER[2C]), PWR_IN (in, see HYDRA_V4_POWER[2A]), PWR_OUT (out, see HYDRA_V4_POWER[2A]), V_SENSE (out, see HYDRA_V4_POWER[2C])

### Nets
GND: C3.2 C4.2 C5.2 D6.2(A) Q12.2(S) R29.1 R35.1 U3.2(V-) U3.5(SHDN) U4.5(GND) U4.7(NC) U4.8(NC) U4.9(NC) U4.10(NC)
INT_3V3: C4.1 U4.12(VCC)
CUR_TRIP_RST: R33.2 ; port CUR_TRIP_RST
CUTOFF_MOSFET: Q11.4(G) Q12.3(D) R23.2 R25.2 R30.1 U3.1(OUT)
M1_PWR: U4.1(IP+) U4.2(IP+) ; port PWR_OUT
M2_I_nFAULT: U4.6(~{FAULT}) ; port I_nFAULT
OC_PROT_PWR_IN: C5.1 R26.1 R27.2 R28.2 U3.6(V+) ; port PWR_IN
POST_SHUNT: Q11.1(S) Q11.2(S) Q11.3(S) R25.1 R26.2 U3.3(-IN)
PRE_PWR_OUT: Q11.5-6-7-8(D) U4.3(IP-) U4.4(IP-)
V_SENSE: R28.1 R29.2 ; port V_SENSE
NetC3_1: C3.1 R27.1 R30.2 U3.4(+IN)
NetD6_1: D6.1(K) R23.1 ; port OC_FAULT
NetQ12_1: Q12.1(G) R33.1 R35.2
NetU4_11: U4.11(VIOUT) ; port I_SENSE

### Notes on the sheet
- Resettable OC Protection
- (near Q11) 10mOhm 1W since P = I^2 * R therefore R = 1 / 10^2 = .01
- (near R27) SIZE IN LAB
- Maybe up wattage
- BIDIRECTIONAL CURRENT SENSE (31A)
- SHDN GROUNDED AS PER P.18 OF DS
- IC FLIPPED TO SIMPLIFY LAYOUT
- NO PU ON FAULT PINS SINCE MUXED WITH OTHER PWR PINS AND THERE'S A PULL UP IN MAIN SCHEM (R76)
- MOSFETs TO ARTIFICIALLY TOGGLE OC PROT LATCH
- SCHEMATICS CHECKED - SERBAN
  DEC 21 2024
  - OC PROT LATCH ok
  - I SENSE ok
  - LATCH SWITCH MOSFETS ok
- (in symbol CMP-04896-000098-1) +; -

### Library data of the parts
C3-C5 = CMP-001-00058-1: as C19 on sheet STM32G473RET6_PINOUT; Value: 100n; Min Operating Temperature: -55°C; Mounting Technology: Surface Mount; Pins: 2; Case/Package: 0402; RoHS Compliant: Yes; Max Operating Temperature: 85°C
D6 = CMP-1060-00750-1: Zener Voltage Regulator, 500 mW, 2-Pin SOD-523, Pb-Free, Tape and Reel; Manufacturer: On Semiconductor; P Max (W): 0.5; VZ Typ (V): 3.3; RoHS: Pb-Free; ComponentLink2Description: Datasheet; PackageReference: SOD-523-2-502-01; DatasheetVersion: Rev. 10; ComponentLink1Description: Manufacturer URL; PackageVersion: Rev. E, 09/2010; ComponentLink3URL: http://www.onsemi.com/pub_link/Collateral/502-01.PDF; ComponentLink2URL: http://www.onsemi.cn/pub_link/Collateral/MM5Z2V4T1-D.PDF; Mounting Technology: Surface Mount; PartNumber: MM5Z3V3T1G; Packing: Tape and Reel; PackageDescription: 2-Pin SOD, Body 1.2 x 0.8 mm; ComponentLink1URL: http://www.onsemi.com/; ComponentLink3Description: Package Specification
Q11 = CMP-013-00018-2: Trans MOSFET P-CH 20V 22.1A 8-Pin PowerPAK 1212 EP T/R; Source: SISH615ADN-T1-GE3.SchLib; Design Item ID: CMP-013-00036-4; Component Type: Standard; Pins: 5
Q12 = CMP-2000-05968-1: N-Channel Enhancement Mode Mosfet, 50 V, 200 mA, -55 to 150 degC, 6-Pin SOT-323, RoHS, Tape and Reel; Typical Turn-Off Delay Time: 20ns; Number of Channels: 1Channel; Type: EnhancementModeFieldEffectTransistor; Brand: DiodesIncorporated; Vds - Drain-Source Breakdown Voltage: 75V; Vgs - Gate-Source Voltage: 20V; Rds On - Drain-Source Resistance: 1.4Ohms; Transistor Type: 1N-Channel; Configuration: Single; Unit Weight: 0.000212oz; Pd - Power Dissipation: 200mW; Id - Continuous Drain Current: 200mA; Forward Transconductance - Min: 0.1S; Manufacturer URL: http://www.diodes.com/; Series: BSS138; Package Description: 3-Pin Small Outline Transistor, Body 2 x 1.25 mm, Pitch 0.65 mm; Mounting Technology: SurfaceMount; Product Category: MOSFET; RoHS: True; Maximum Operating Temperature: +150C; Height: 1mm; Length: 2.2mm; Technology: Si; Width: 1.35mm; Datasheet URL: http://www.diodes.com/_files/datasheets/ds30206.pdf; Manufacturer: DiodesIncorporated; Package / Case: SOT-323-3; Typical Turn-On Delay Time: 20ns; Transistor Polarity: N-Channel; Factory Pack Quantity: 3000; Packaging: Reel; Product: MOSFETSmallSignal; Datasheet Version: Rev. 11-2, 09/2013; Package Reference: SOT323; Minimum Operating Temperature: -55C; Mounting Style: SMD/SMT; Channel Mode: Enhancement
R23 R25 R27-R30 R33 R35 = CMP-009-00002-14: Resistor
  R23 R30: Value: 1M
  R25 R28 R35: Value: 100k
  R27: Value: TBD
  R29: Value: 24k
  R33: Value: 1k
R26 = CMP-2003-04373-2: RES 0.01 OHM 1% 1W 1206; Temperature Coefficient: 75ppm/°C; Resistance: 10mR; Features: Moisture Resistant; Case/Package: 1206; Military Standard: Not; Case Code (Imperial): 1206; Power Rating: 1W; Number of Terminations: 2; Lead Free: Lead Free; Number of Pins: 2; Min Operating Temperature: -65°C; Weight: 0.000571oz; Radiation Hardening: No; Series: WSLP; Length: 3.2mm; Termination: SMD/SMT; Mount: Surface Mount; Size Code: 1206; Height: 0.035inch; Case Code (Metric): 3216; Resistance Tolerance: 1%; Contact Plating: Tin; Width: 0.063inch; Construction: Rectangular; Packaging: Tape and Reel; Package Quantity: 1; RoHS Compliant: Yes; Depth: 1.6mm; Tolerance: 1%; Max Operating Temperature: 170°C; Max Power Dissipation: 1W; Resistor Type: Metal Strip; Value: WSLP1206R0100FEA
U3 = CMP-04896-000098-1: 40V, RAIL-TO-RAIL INPUT, PUSH-PU
U4 = CMP-1557-00002-1: Hall Effect Linear Current Sensor with Overcurrent Fault Output for <100 V Isolation Applications, 3 to 5.5 V, -31 to 31 A IP, -40 to 125 degC, 12-Pin QFN (EX), RoHS, Tape and Reel; IP Max: 31 A; VCC Min: 3 V; -3dB Bandwidth: 0.1 MHz; VCC Max: 5.5 V; IP Min: -31 A; Mounting Technology: Surface Mount; DatasheetVersion: Rev. 3; Temperature Min: -40 degC; ComponentLink1Description: Manufacturer URL; Packing: Tape and Reel; PartNumber: ACS711KEXLT-31AB-T; Temperature Max: 125 degC; ComponentLink2Description: Datasheet; ComponentLink3Description: Package Specification; RoHS: TRUE; ComponentLink1URL: http://www.allegromicro.com/; ComponentLink2URL: http://www.allegromicro.com/~/media/Files/Datasheets/ACS711-Datasheet.ashx?la=en; PackageDescription: 12-Pin Quad Flat No-Lead, Body 3 x 3 mm, Height 0.8 mm; ComponentLink3URL: http://www.allegromicro.com/~/media/Files/Datasheets/ACS711-Datasheet.ashx?la=en

## Sheet CELL_SENSE.SchDoc
size A; SheetNumber: 7; SheetTotal: 11
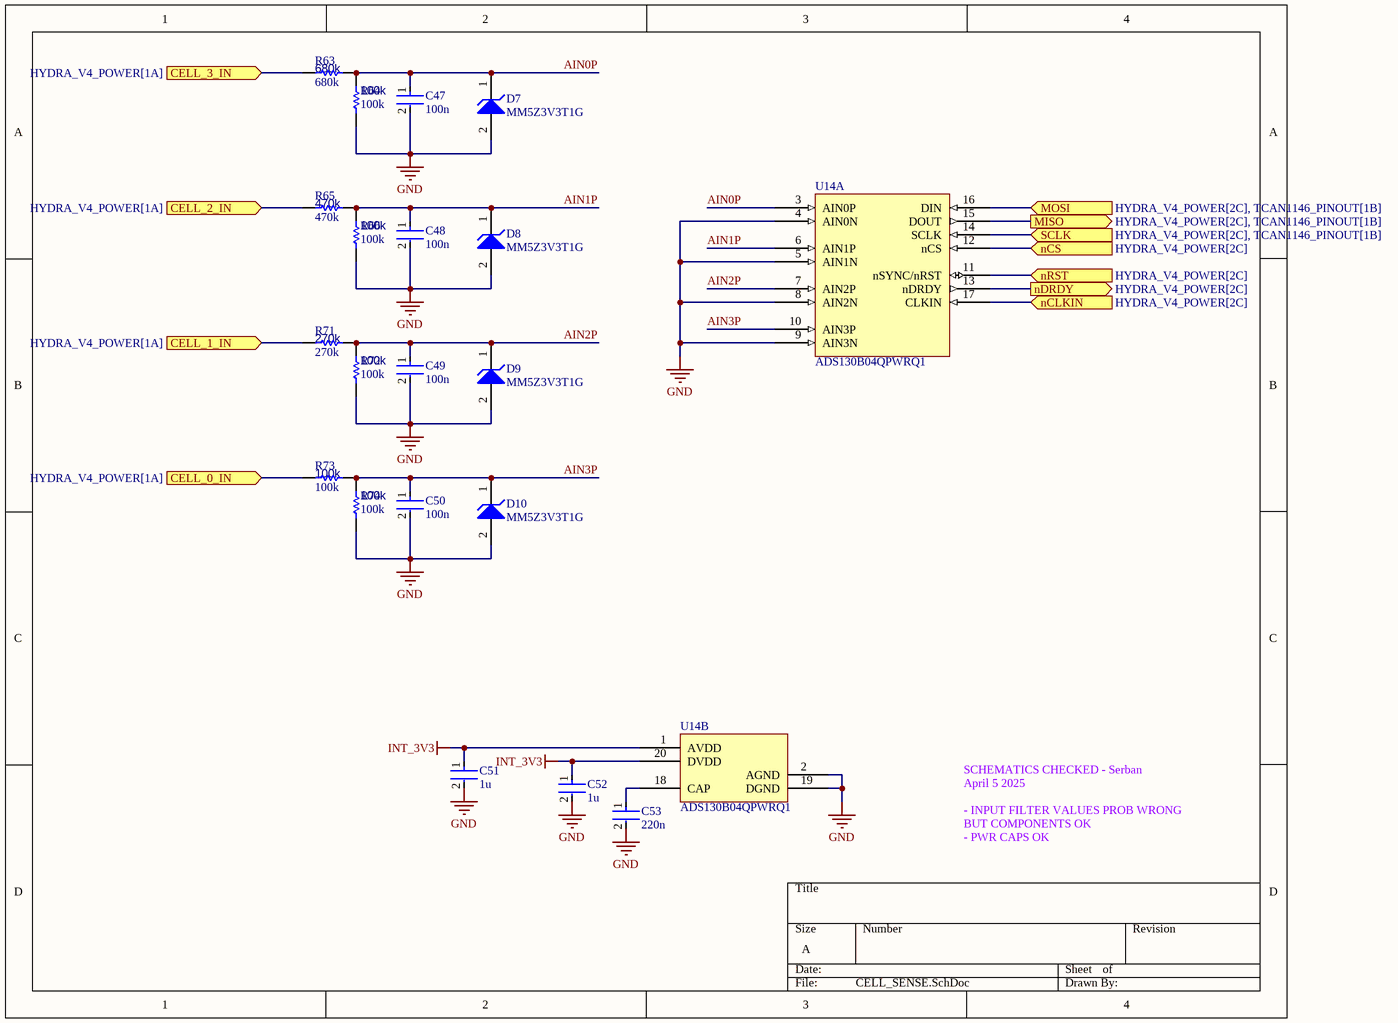
[diagram p6: CELL_SENSE.SchDoc]

### Parts
C47  100n  [FP-0402-L_1_0_0_05-W_0_5-IPC_A]
C48  100n  [FP-0402-L_1_0_0_05-W_0_5-IPC_A]
C49  100n  [FP-0402-L_1_0_0_05-W_0_5-IPC_A]
C50  100n  [FP-0402-L_1_0_0_05-W_0_5-IPC_A]
C51  1u  [FP-0402-L_1_0_0_05-W_0_5-IPC_A]
C52  1u  [FP-0402-L_1_0_0_05-W_0_5-IPC_A]
C53  220n  [FP-0402-L_1_0_0_05-W_0_5-IPC_A]
D7  MM5Z3V3T1G  [ONSC-SOD-523-2-502-01_V]
D8  MM5Z3V3T1G  [ONSC-SOD-523-2-502-01_V]
D9  MM5Z3V3T1G  [ONSC-SOD-523-2-502-01_V]
D10  MM5Z3V3T1G  [ONSC-SOD-523-2-502-01_V]
R63  680k  [R0603B]
R64  100k  [R0603B]
R65  470k  [R0603B]
R66  100k  [R0603B]
R71  270k  [R0603B]
R72  100k  [R0603B]
R73  100k  [R0603B]
R74  100k  [R0603B]
U14  ADS130B04QPWRQ1  [TSOP65P640X120-20N]  (parts A,B of 2)

### Ports
CELL_0_IN (in, see HYDRA_V4_POWER[1A]), CELL_1_IN (in, see HYDRA_V4_POWER[1A]), CELL_2_IN (in, see HYDRA_V4_POWER[1A]), CELL_3_IN (in, see HYDRA_V4_POWER[1A]), MISO (out, see HYDRA_V4_POWER[2C], TCAN1146_PINOUT[1B]), MOSI (in, see HYDRA_V4_POWER[2C], TCAN1146_PINOUT[1B]), nCLKIN (in, see HYDRA_V4_POWER[2C]), nCS (in, see HYDRA_V4_POWER[2C]), nDRDY (out, see HYDRA_V4_POWER[2C]), nRST (in, see HYDRA_V4_POWER[2C]), SCLK (in, see HYDRA_V4_POWER[2C], TCAN1146_PINOUT[1B])

### Nets
GND: C47.2 C48.2 C49.2 C50.2 C51.2 C52.2 C53.2 D7.2(A) D8.2(A) D9.2(A) D10.2(A) R64.2 R66.2 R72.2 R74.2 U14.2(AGND) U14.4(AIN0N) U14.5(AIN1N) U14.8(AIN2N) U14.9(AIN3N) U14.19(DGND)
INT_3V3: C51.1 C52.1 U14.1(AVDD) U14.20(DVDD)
ADC_MISO: U14.15(DOUT) ; port MISO
ADC_MOSI: U14.16(DIN) ; port MOSI
ADC_SCLK: U14.14(SCLK) ; port SCLK
AIN0P: C47.1 D7.1(K) R63.1 R64.1 U14.3(AIN0P)
AIN1P: C48.1 D8.1(K) R65.1 R66.1 U14.6(AIN1P)
AIN2P: C49.1 D9.1(K) R71.1 R72.1 U14.7(AIN2P)
AIN3P: C50.1 D10.1(K) R73.1 R74.1 U14.10(AIN3P)
CELL_0_IN: R73.2 ; port CELL_0_IN
CELL_1_IN: R71.2 ; port CELL_1_IN
CELL_2_IN: R65.2 ; port CELL_2_IN
CELL_3_IN: R63.2 ; port CELL_3_IN
NetC53_1: C53.1 U14.18(CAP)
NetU9_30: U14.11(nSYNC/nRST) ; port nRST
NetU9_34: U14.12(nCS) ; port nCS
NetU14_13: U14.13(nDRDY) ; port nDRDY
NetU14_17: U14.17(CLKIN) ; port nCLKIN

### Notes on the sheet
- SCHEMATICS CHECKED - Serban
  April 5 2025
  - INPUT FILTER VALUES PROB WRONG BUT COMPONENTS OK
  - PWR CAPS OK

### Library data of the parts
C47-C53 = CMP-001-00058-1: as C19 on sheet STM32G473RET6_PINOUT; Min Operating Temperature: -55°C; Mounting Technology: Surface Mount; Pins: 2; Case/Package: 0402; RoHS Compliant: Yes; Max Operating Temperature: 85°C
  C47-C50: Value: 100n
  C51 C52: Value: 1u
  C53: Value: 220n
D7-D10 = CMP-1060-00750-1: as D6 on sheet PWR_PROT; RoHS: Pb-Free; ComponentLink2Description: Datasheet; PackageReference: SOD-523-2-502-01; DatasheetVersion: Rev. 10; ComponentLink1Description: Manufacturer URL; PackageVersion: Rev. E, 09/2010; ComponentLink3URL: http://www.onsemi.com/pub_link/Collateral/502-01.PDF; ComponentLink2URL: http://www.onsemi.cn/pub_link/Collateral/MM5Z2V4T1-D.PDF; Mounting Technology: Surface Mount; PartNumber: MM5Z3V3T1G; Packing: Tape and Reel; PackageDescription: 2-Pin SOD, Body 1.2 x 0.8 mm; ComponentLink1URL: http://www.onsemi.com/; ComponentLink3Description: Package Specification
R63-R66 R71-R74 = CMP-009-00002-14: Resistor
  R63: Value: 680k
  R64 R66 R72-R74: Value: 100k
  R65: Value: 470k
  R71: Value: 270k
U14 = CMP-015-00014-2: Automotive 16-bit, 32-kSPS, four-channel, simultaneous-sampling, delta-sigma ADC 20-TSSOP -40 to 125

## Sheet MOSFET_JUNCTION.SchDoc
size C; SheetNumber: 2; SheetTotal: 11
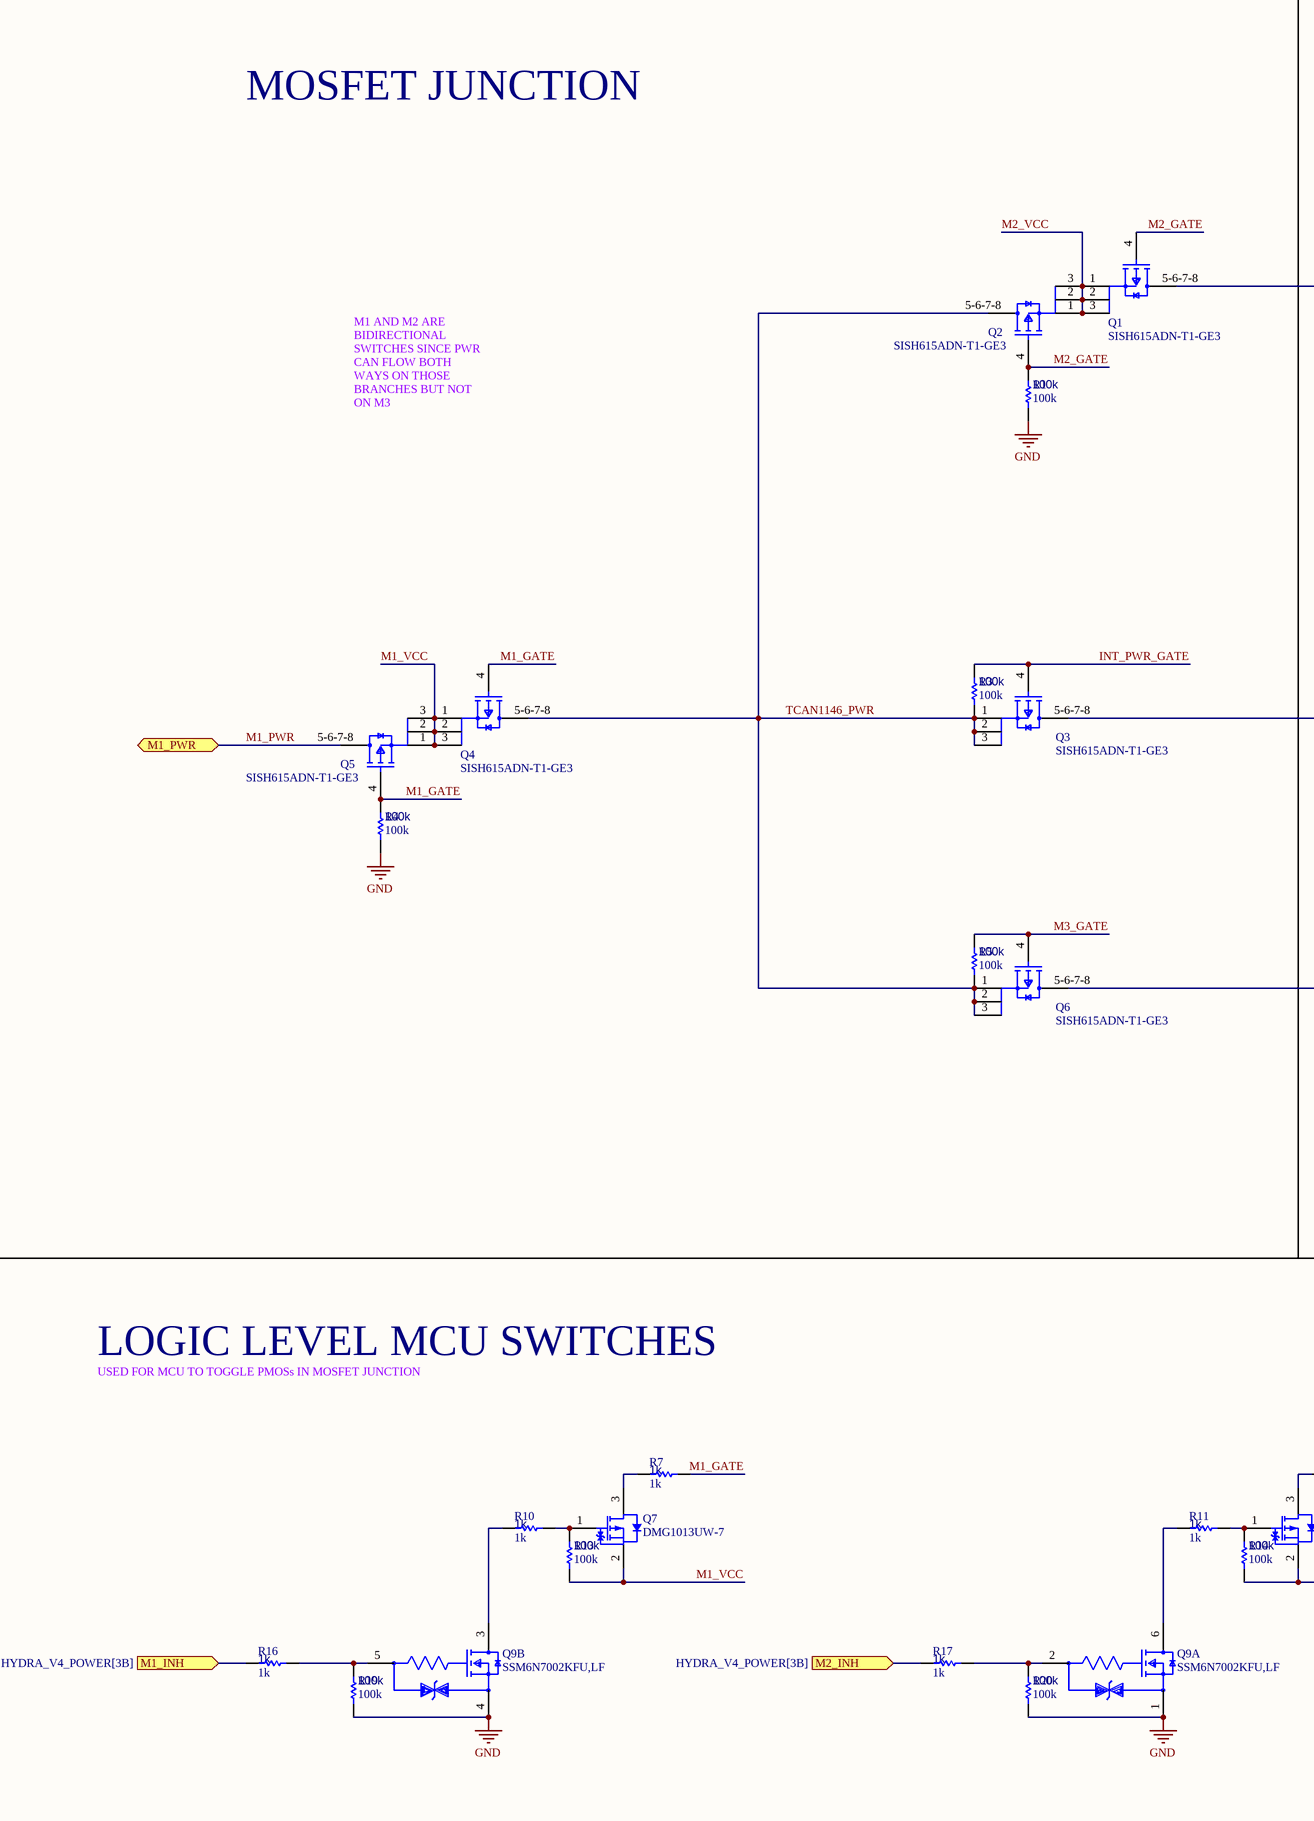
[diagram p7: MOSFET_JUNCTION.SchDoc, left]
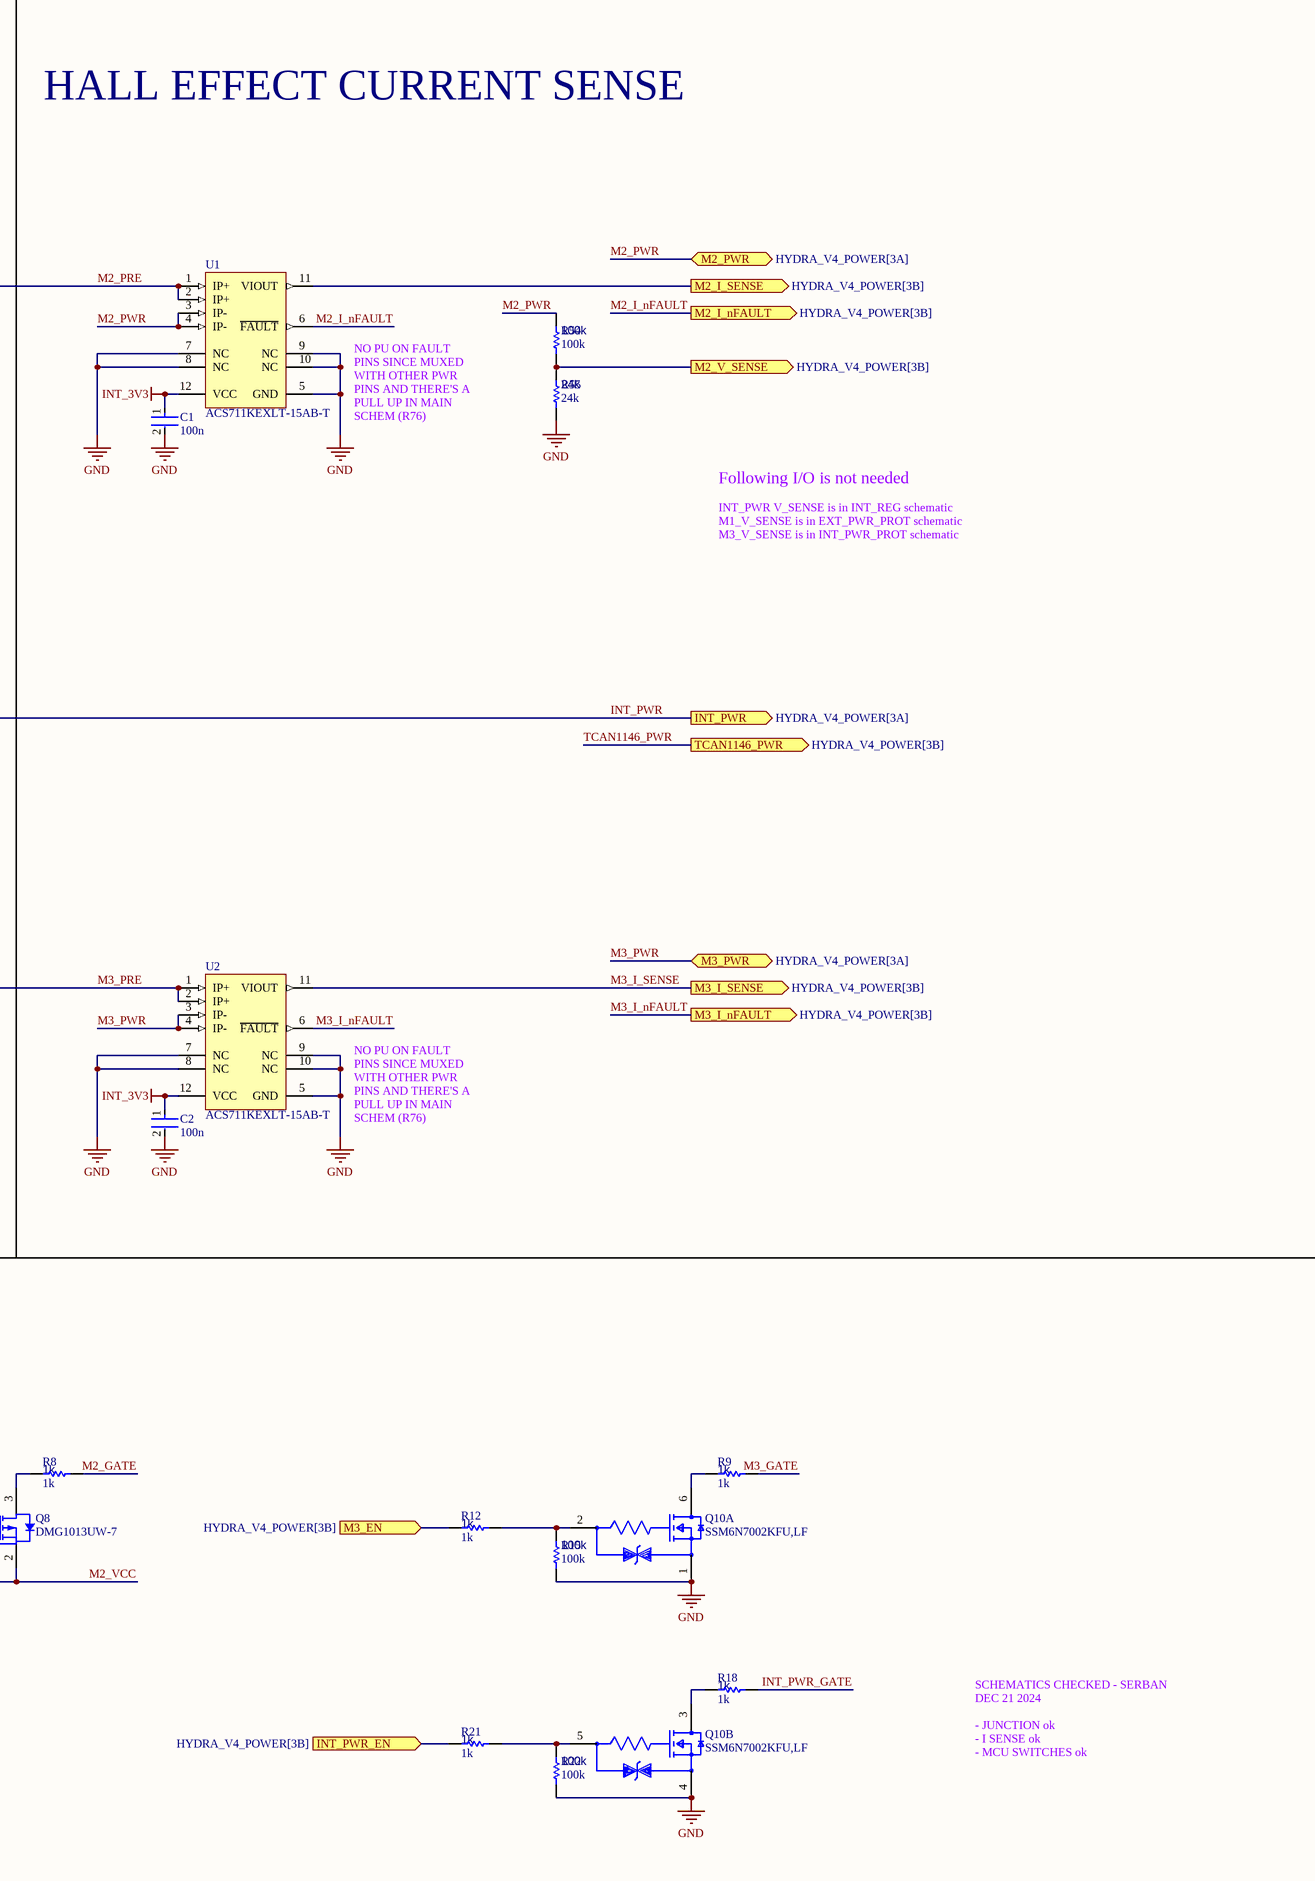
[diagram p8: MOSFET_JUNCTION.SchDoc, right]

### Parts
C1  100n  [FP-0402-L_1_0_0_05-W_0_5-IPC_A]
C2  100n  [FP-0402-L_1_0_0_05-W_0_5-IPC_A]
Q1  SISH615ADN-T1-GE3  [SISH615ADN-T1-GE3-Footprint-1]
Q2  SISH615ADN-T1-GE3  [SISH615ADN-T1-GE3-Footprint-1]
Q3  SISH615ADN-T1-GE3  [SISH615ADN-T1-GE3-Footprint-1]
Q4  SISH615ADN-T1-GE3  [SISH615ADN-T1-GE3-Footprint-1]
Q5  SISH615ADN-T1-GE3  [SISH615ADN-T1-GE3-Footprint-1]
Q6  SISH615ADN-T1-GE3  [SISH615ADN-T1-GE3-Footprint-1]
Q7  DMG1013UW-7  [DIOD-SOT323-3_V]
Q8  DMG1013UW-7  [DIOD-SOT323-3_V]
Q9  SSM6N7002KFU,LF  [FP-SSOP6-P-0_65A-MFG]  (parts A,B of 2)
Q10  SSM6N7002KFU,LF  [FP-SSOP6-P-0_65A-MFG]  (parts A,B of 2)
R1  100k  [R0603B]
R3  100k  [R0603B]
R4  100k  [R0603B]
R5  100k  [R0603B]
R7  1k  [R0603B]
R8  1k  [R0603B]
R9  1k  [R0603B]
R10  1k  [R0603B]
R11  1k  [R0603B]
R12  1k  [R0603B]
R13  100k  [R0603B]
R14  100k  [R0603B]
R15  100k  [R0603B]
R16  1k  [R0603B]
R17  1k  [R0603B]
R18  1k  [R0603B]
R19  100k  [R0603B]
R20  100k  [R0603B]
R21  1k  [R0603B]
R22  100k  [R0603B]
R54  100k  [R0603B]
R55  24k  [R0603B]
U1  ACS711KEXLT-15AB-T  [ALEG-EX-12_V]
U2  ACS711KEXLT-15AB-T  [ALEG-EX-12_V]

### Ports
INT_PWR (out, see HYDRA_V4_POWER[3A]), INT_PWR_EN (in, see HYDRA_V4_POWER[3B]), M1_INH (in, see HYDRA_V4_POWER[3B]), M1_PWR (bidir, see HYDRA_V4_POWER[3A]), M2_I_nFAULT (out, see HYDRA_V4_POWER[3B]), M2_I_SENSE (out, see HYDRA_V4_POWER[3B]), M2_INH (in, see HYDRA_V4_POWER[3B]), M2_PWR (bidir, see HYDRA_V4_POWER[3A]), M2_V_SENSE (out, see HYDRA_V4_POWER[3B]), M3_EN (in, see HYDRA_V4_POWER[3B]), M3_I_nFAULT (out, see HYDRA_V4_POWER[3B]), M3_I_SENSE (out, see HYDRA_V4_POWER[3B]), M3_PWR (bidir, see HYDRA_V4_POWER[3A]), TCAN1146_PWR (out, see HYDRA_V4_POWER[3B])

### Nets
GND: C1.2 C2.2 Q9.1(Source1) Q9.4(Source2) Q10.1(Source1) Q10.4(Source2) R1.1 R4.1 R15.1 R19.1 R20.1 R22.1 R55.1 U1.5(GND) U1.7(NC) U1.8(NC) U1.9(NC) U1.10(NC) U2.5(GND) U2.7(NC) U2.8(NC) U2.9(NC) U2.10(NC)
INT_3V3: C1.1 C2.1 U1.12(VCC) U2.12(VCC)
INT_PWR: Q3.5-6-7-8(D) ; port INT_PWR
TCAN1146_PWR: Q2.5-6-7-8(D) Q3.1(S) Q3.2(S) Q3.3(S) Q4.5-6-7-8(D) Q6.1(S) Q6.2(S) Q6.3(S) R3.1 R5.1 ; port TCAN1146_PWR
INT_PWR_GATE: Q3.4(G) R3.2 R18.1
M1_GATE: Q4.4(G) Q5.4(G) R4.2 R7.1
M1_INH: R16.2 ; port M1_INH
M1_PWR: Q5.5-6-7-8(D) ; port M1_PWR
M1_VCC: Q4.1(S) Q4.2(S) Q4.3(S) Q5.1(S) Q5.2(S) Q5.3(S) Q7.2(S) R13.2
M2_GATE: Q1.4(G) Q2.4(G) R1.2 R8.1
M2_I_nFAULT: U1.6(~{FAULT}) U2.6(~{FAULT}) ; port M2_I_nFAULT, port M3_I_nFAULT  [also labelled M3_I_nFAULT]
M2_PRE: Q1.5-6-7-8(D) U1.1(IP+) U1.2(IP+)
M2_PWR: R54.2 U1.3(IP-) U1.4(IP-) ; port M2_PWR
M2_VCC: Q1.1(S) Q1.2(S) Q1.3(S) Q2.1(S) Q2.2(S) Q2.3(S) Q8.2(S) R14.2
M3_GATE: Q6.4(G) R5.2 R9.1
M3_I_SENSE: U2.11(VIOUT) ; port M3_I_SENSE
M3_PRE: Q6.5-6-7-8(D) U2.1(IP+) U2.2(IP+)
M3_PWR: U2.3(IP-) U2.4(IP-) ; port M3_PWR
TCAN1146_INH: R21.2 ; port INT_PWR_EN
NetQ7_1: Q7.1(G) R10.1 R13.1
NetQ7_3: Q7.3(D) R7.2
NetQ8_1: Q8.1(G) R11.1 R14.1
NetQ8_3: Q8.3(D) R8.2
NetQ9_2: Q9.2(Gate1) R17.1 R20.2
NetQ9_3: Q9.3(Drain2) R10.2
NetQ9_5: Q9.5(Gate2) R16.1 R19.2
NetQ9_6: Q9.6(Drain1) R11.2
NetQ10_2: Q10.2(Gate1) R12.1 R15.2
NetQ10_3: Q10.3(Drain2) R18.2
NetQ10_5: Q10.5(Gate2) R21.1 R22.2
NetQ10_6: Q10.6(Drain1) R9.2
NetR12_2: R12.2 ; port M3_EN
NetR17_2: R17.2 ; port M2_INH
NetR54_1: R54.1 R55.2 ; port M2_V_SENSE
NetU1_11: U1.11(VIOUT) ; port M2_I_SENSE

### Notes on the sheet
- MOSFET JUNCTION
- HALL EFFECT CURRENT SENSE
- M1 AND M2 ARE BIDIRECTIONAL SWITCHES SINCE PWR CAN FLOW BOTH WAYS ON THOSE BRANCHES BUT NOT ON M3
- NO PU ON FAULT PINS SINCE MUXED WITH OTHER PWR PINS AND THERE'S A PULL UP IN MAIN SCHEM (R76)
- INT_PWR V_SENSE is in INT_REG schematic
- M1_V_SENSE is in EXT_PWR_PROT schematic
- M3_V_SENSE is in INT_PWR_PROT schematic
- Following I/O is not needed
- LOGIC LEVEL MCU SWITCHES
- USED FOR MCU TO TOGGLE PMOSs IN MOSFET JUNCTION
- SCHEMATICS CHECKED - SERBAN
  DEC 21 2024
  - JUNCTION ok
  - I SENSE ok
  - MCU SWITCHES ok

### Library data of the parts
C1 C2 = CMP-001-00058-1: as C19 on sheet STM32G473RET6_PINOUT; Value: 100n; Min Operating Temperature: -55°C; Mounting Technology: Surface Mount; Pins: 2; Case/Package: 0402; RoHS Compliant: Yes; Max Operating Temperature: 85°C
Q1-Q6 = CMP-013-00018-2: as Q11 on sheet PWR_PROT; Source: SISH615ADN-T1-GE3.SchLib; Design Item ID: CMP-013-00036-4; Component Type: Standard; Pins: 5
Q7 Q8 = CMP-2000-06170-1: as Q14 on sheet HYDRA_V4_POWER; Package Reference: SOT323; Datasheet Version: Rev. 3-2, 09/2013; Package Description: 3-Pin Small Outline Transistor, Body 2 x 1.25 mm, Pitch 0.65 mm; Mounting Technology: SurfaceMount; Manufacturer URL: http://www.diodes.com/; Datasheet URL: http://www.diodes.com/_files/datasheets/ds31861.pdf; Channel Type: P-Channel
Q9 Q10 = CMP-35916-000009-1: MOSFET 2N-CH 60V 0.3A; Input Capacitance: 40pF; Continuous Drain Current (ID): 300mA; Max Power Dissipation: 285mW; FET Type: 2 N-Channel; Rds On Max: 1.5R; Mount: Surface Mount; Drain to Source Voltage (Vdss): 60V; Packaging: Tape and Reel
R1 R3-R5 R7-R22 R54 R55 = CMP-009-00002-14: Resistor
  R1 R3-R5 R13-R15 R19 R20 R22 R54: Value: 100k
  R7-R12 R16-R18 R21: Value: 1k
  R55: Value: 24k
U1 U2 = CMP-1557-00001-1: Hall Effect Linear Current Sensor with Overcurrent Fault Output for <100 V Isolation Applications, 3 to 5.5 V, -15.5 to 15.5 A IP, -40 to 125 degC, 12-Pin QFN (EX), RoHS, Tape and Reel; VCC Max: 5.5 V; IP Max: 15.5 A; VCC Min: 3 V; IP Min: -15.5 A; -3dB Bandwidth: 0.1 MHz; PackageDescription: 12-Pin Quad Flat No-Lead, Body 3 x 3 mm, Height 0.8 mm; ComponentLink1URL: http://www.allegromicro.com/; Packing: Tape and Reel; ComponentLink2URL: http://www.allegromicro.com/~/media/Files/Datasheets/ACS711-Datasheet.ashx?la=en; DatasheetVersion: Rev. 3; PartNumber: ACS711KEXLT-15AB-T; ComponentLink2Description: Datasheet; ComponentLink3URL: http://www.allegromicro.com/~/media/Files/Datasheets/ACS711-Datasheet.ashx?la=en; RoHS: TRUE; ComponentLink1Description: Manufacturer URL; ComponentLink3Description: Package Specification; Temperature Max: 125 degC; Mounting Technology: Surface Mount; Temperature Min: -40 degC

## Sheet INT_REG.SchDoc
size A; SheetNumber: 4; SheetTotal: 11
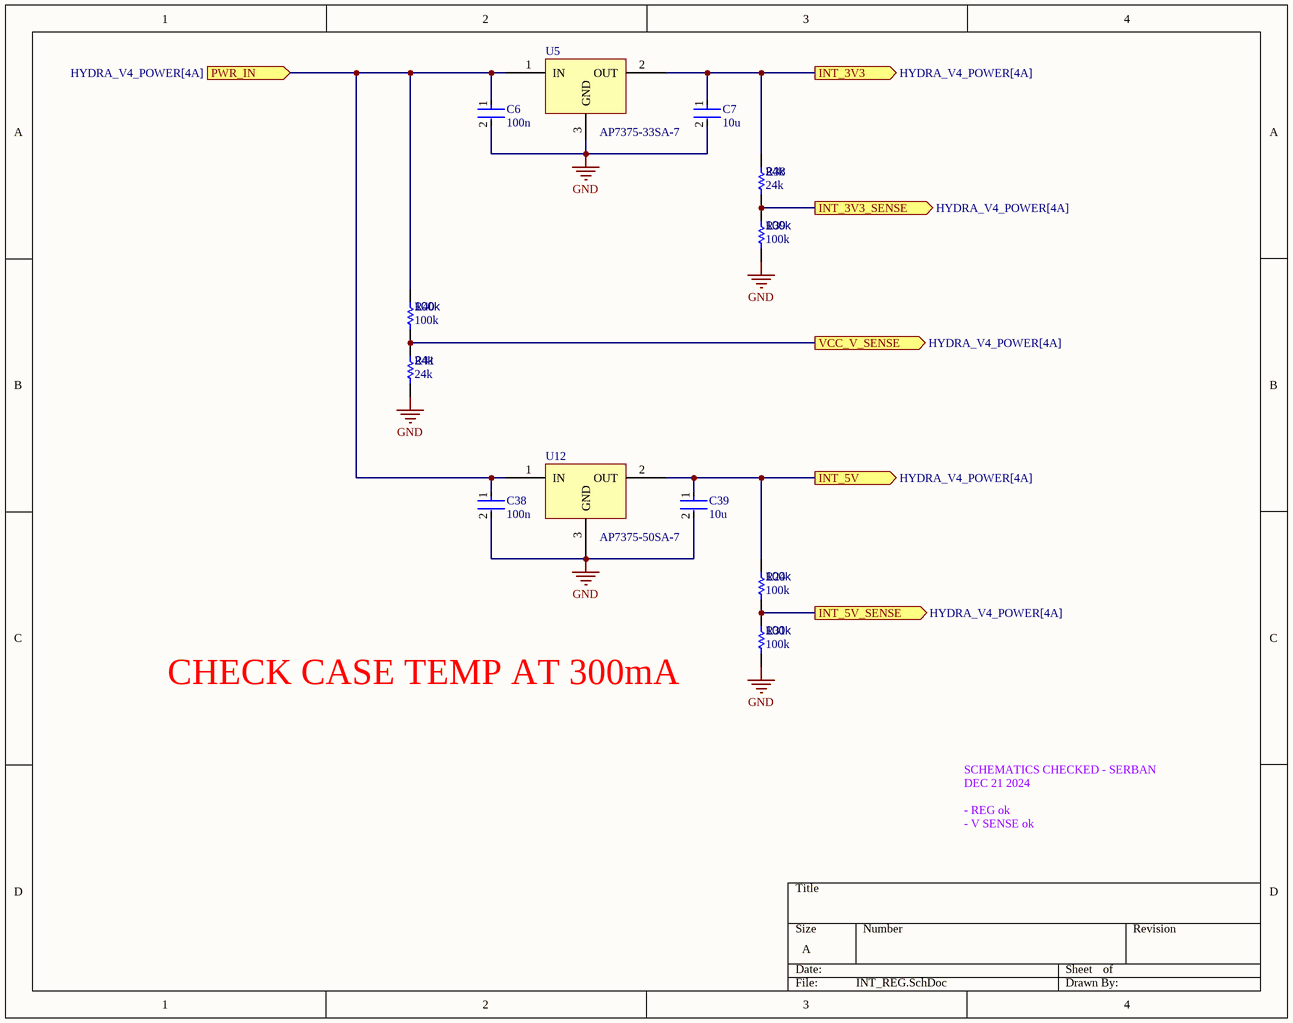
[diagram p9: INT_REG.SchDoc]

### Parts
C6  100n  [FP-0402-L_1_0_0_05-W_0_5-IPC_A]
C7  10u  [FP-0402-L_1_0_0_05-W_0_5-IPC_A]
C38  100n  [FP-0402-L_1_0_0_05-W_0_5-IPC_A]
C39  10u  [FP-0402-L_1_0_0_05-W_0_5-IPC_A]
R24  100k  [R0603B]
R31  100k  [R0603B]
R38  24k  [R0603B]
R39  100k  [R0603B]
R40  100k  [R0603B]
R41  24k  [R0603B]
U5  AP7375-33SA-7  [SOT90P285X110-3N]
U12  AP7375-50SA-7  [AP7375-50SA-7-Footprint-1]

### Ports
INT_3V3 (out, see HYDRA_V4_POWER[4A]), INT_3V3_SENSE (out, see HYDRA_V4_POWER[4A]), INT_5V (out, see HYDRA_V4_POWER[4A]), INT_5V_SENSE (out, see HYDRA_V4_POWER[4A]), PWR_IN (in, see HYDRA_V4_POWER[4A]), VCC_V_SENSE (out, see HYDRA_V4_POWER[4A])

### Nets
5V_INT: C39.1 R24.2 U12.2(OUT) ; port INT_5V
GND: C6.2 C7.2 C38.2 C39.2 R31.1 R39.1 R41.1 U5.3(GND) U12.3(GND)
INT_3V3: C7.1 R38.2 U5.2(OUT) ; port INT_3V3
NetC6_1: C6.1 C38.1 R40.2 U5.1(IN) U12.1(IN) ; port PWR_IN
NetR24_1: R24.1 R31.2 ; port INT_5V_SENSE
NetR38_1: R38.1 R39.2 ; port INT_3V3_SENSE
NetR40_1: R40.1 R41.2 ; port VCC_V_SENSE

### Notes on the sheet
- CHECK CASE TEMP AT 300mA
- SCHEMATICS CHECKED - SERBAN
  DEC 21 2024
  - REG ok
  - V SENSE ok

### Library data of the parts
C6 C7 C38 C39 = CMP-001-00058-1: as C19 on sheet STM32G473RET6_PINOUT; Min Operating Temperature: -55°C; Mounting Technology: Surface Mount; Pins: 2; Case/Package: 0402; RoHS Compliant: Yes; Max Operating Temperature: 85°C
  C6 C38: Value: 100n
  C7 C39: Value: 10u
R24 R31 R38-R41 = CMP-009-00002-14: Resistor
  R24 R31 R39 R40: Value: 100k
  R38 R41: Value: 24k
U5 = CMP-019-00039-1: LDO Regulator Pos 3.3V 0.3A 3-Pin SOT-23 T/R
U12 = CMP-019-00041-1: Ldo Cmos Lowcurr SOT23 T&r 3K